# EAGLE design palm (EAGLE 9.6.2)
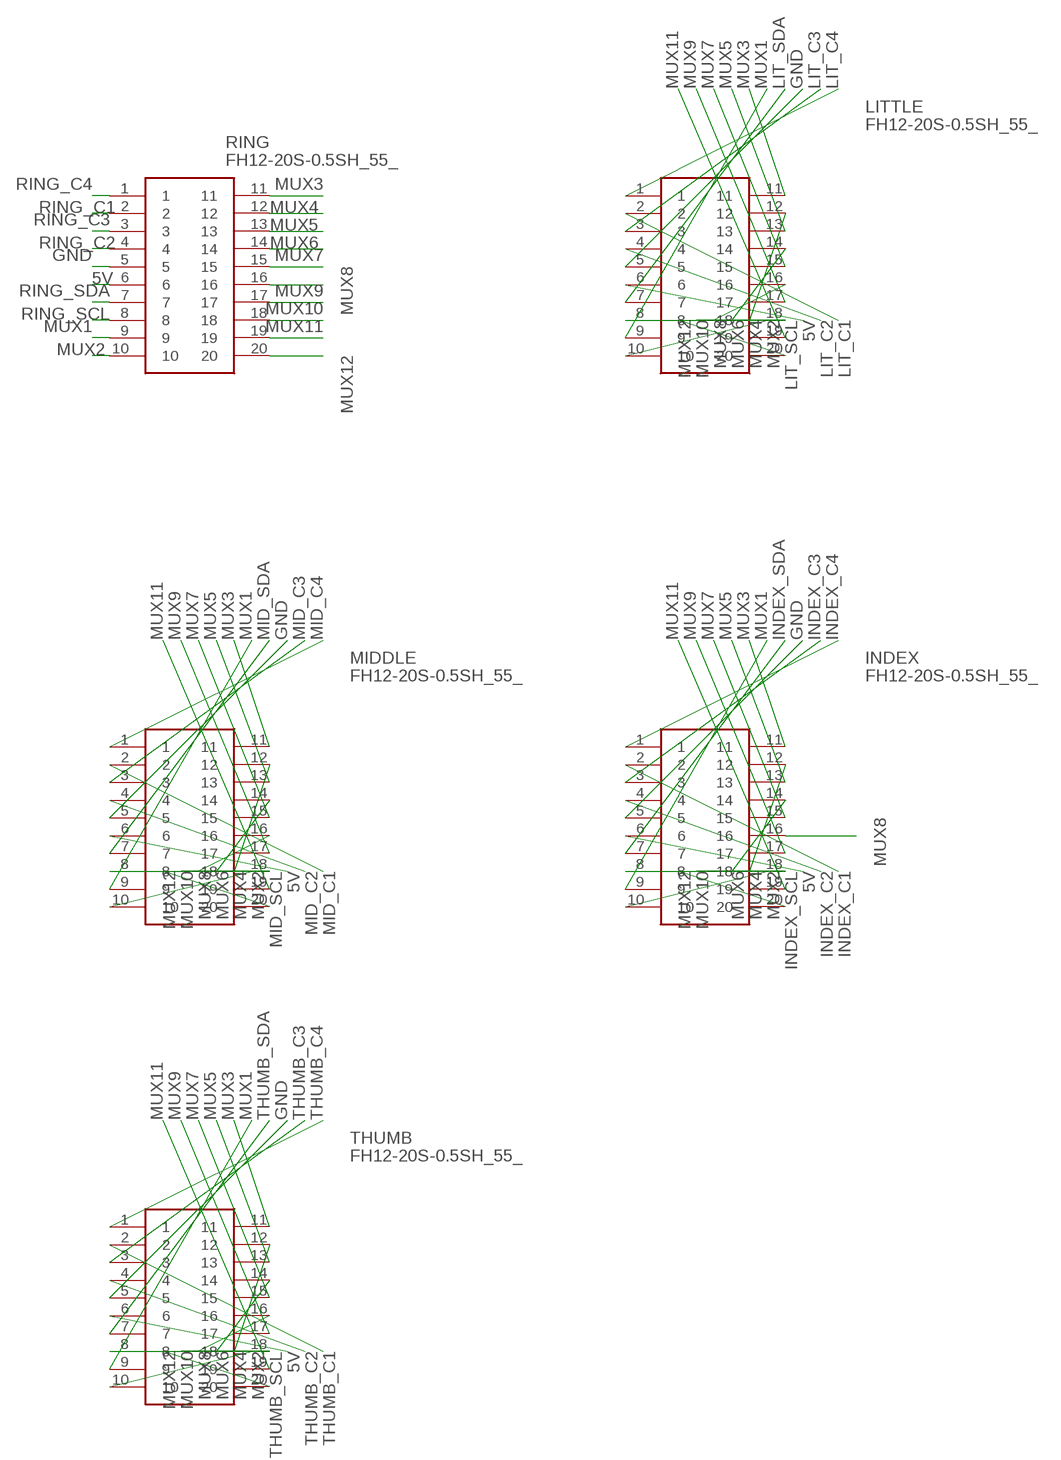
[diagram p0: schematic, sheet 1, part 1 of 2]
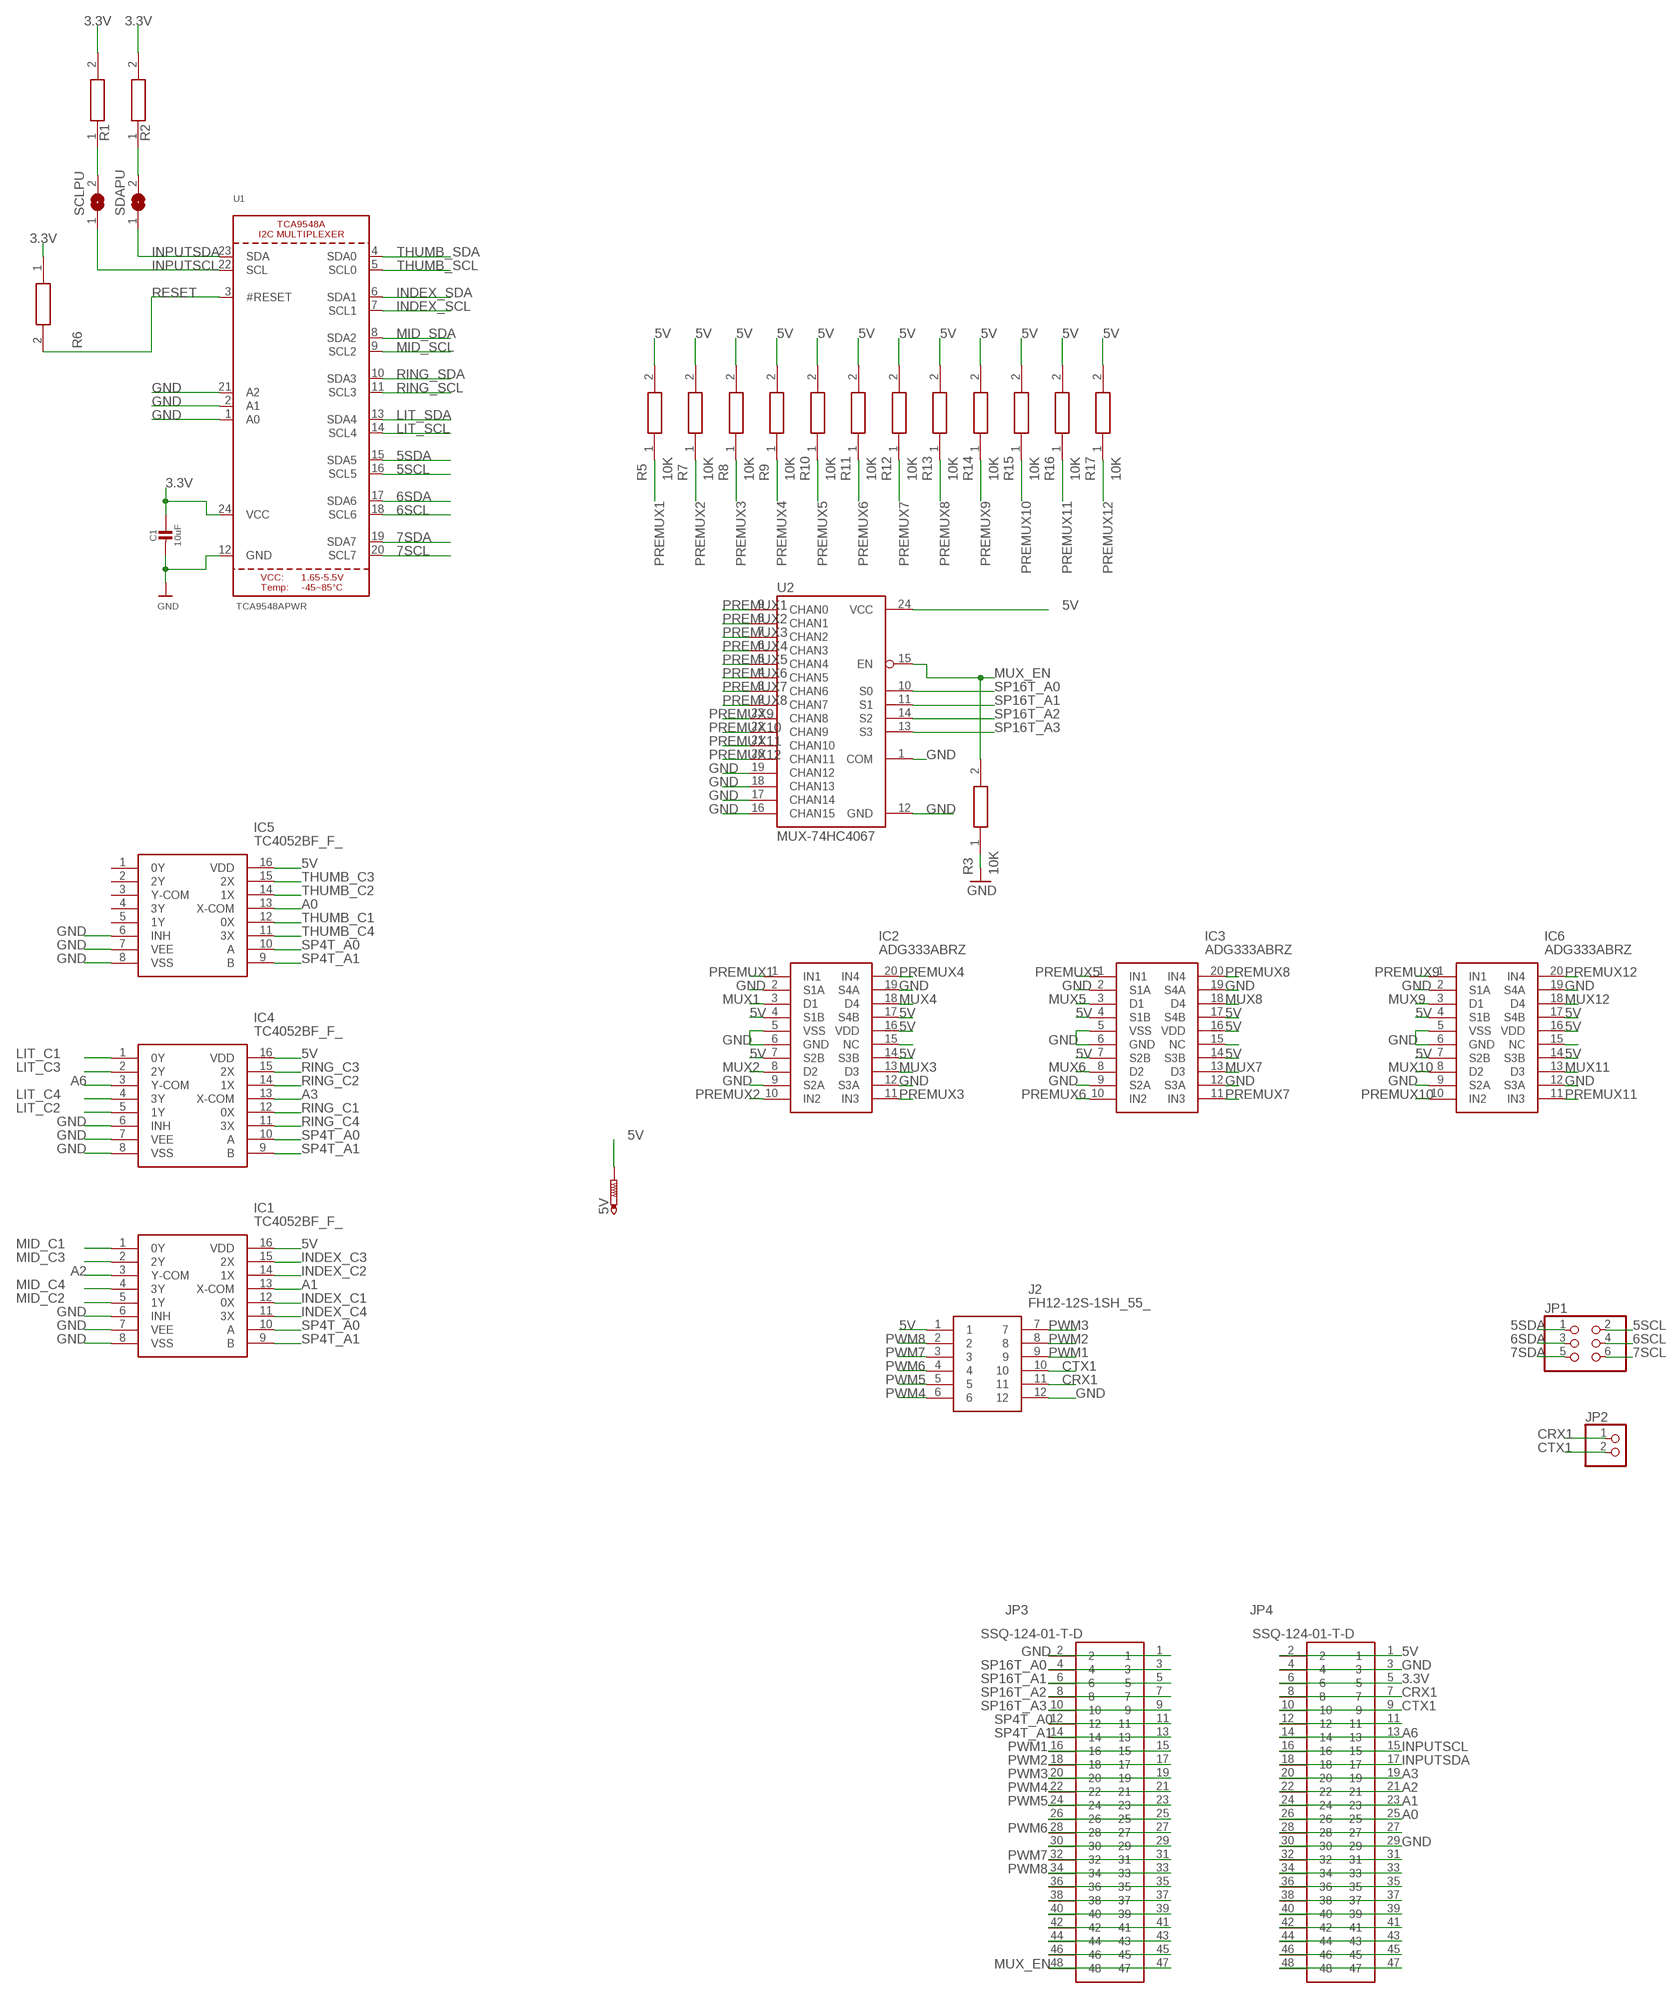
[diagram p1: schematic, sheet 1, part 2 of 2]

## Parts
5V  PTR1B1,27  [B1,27]
C1  10uF  CAP_CERAMIC0805-NOOUTLINE  [0805-NO]
IC1  TC4052BF_F_  [SOIC127P780X190-16N]
IC2  ADG333ABRZ  [SOIC127P1032X265-20N]
IC3  ADG333ABRZ  [SOIC127P1032X265-20N]
IC4  TC4052BF_F_  [SOIC127P780X190-16N]
IC5  TC4052BF_F_  [SOIC127P780X190-16N]
IC6  ADG333ABRZ  [SOIC127P1032X265-20N]
INDEX  FH12-20S-0.5SH_55_  [FH12-20S-0.5SH(55)]
J2  FH12-12S-1SH_55_  [FH12-12S-1SH(55)]
JP1  PINHD-2X3  [2X03]
JP2  PINHD-1X2  [1X02]
JP3  SSQ-124-01-T-D  [SSQ-124-XX-YYY]
JP4  SSQ-124-01-T-D  [SSQ-124-XX-YYY]
LITTLE  FH12-20S-0.5SH_55_  [FH12-20S-0.5SH(55)]
MIDDLE  FH12-20S-0.5SH_55_  [FH12-20S-0.5SH(55)]
R1  ERJ-S02J103X  [RESC1005X40N]
R2  ERJ-S02J103X  [RESC1005X40N]
R3  10K  ERJ-S02J103X  [RESC1005X40N]
R5  10K  ERJ-S02J103X  [RESC1005X40N]
R6  ERJ-S02J103X  [RESC1005X40N]
R7  10K  ERJ-S02J103X  [RESC1005X40N]
R8  10K  ERJ-S02J103X  [RESC1005X40N]
R9  10K  ERJ-S02J103X  [RESC1005X40N]
R10  10K  ERJ-S02J103X  [RESC1005X40N]
R11  10K  ERJ-S02J103X  [RESC1005X40N]
R12  10K  ERJ-S02J103X  [RESC1005X40N]
R13  10K  ERJ-S02J103X  [RESC1005X40N]
R14  10K  ERJ-S02J103X  [RESC1005X40N]
R15  10K  ERJ-S02J103X  [RESC1005X40N]
R16  10K  ERJ-S02J103X  [RESC1005X40N]
R17  10K  ERJ-S02J103X  [RESC1005X40N]
RING  FH12-20S-0.5SH_55_  [FH12-20S-0.5SH(55)]
SCLPU  SOLDERJUMPERCLOSED  [SOLDERJUMPER_CLOSEDWIRE]
SDAPU  SOLDERJUMPERCLOSED  [SOLDERJUMPER_CLOSEDWIRE]
THUMB  FH12-20S-0.5SH_55_  [FH12-20S-0.5SH(55)]
U1  TCA9548APWR  TCA9548A  [TSSOP24]
U2  MUX-74HC4067  MUX-74HC4067SMD  [SSOP24]

## Nets
3.3V: C1.1 JP4.5 JP4.6 R1.2 R2.2 R6.1 U1.24(VCC)
5SCL: JP1.2 U1.16(SCL5)
5SDA: JP1.1 U1.15(SDA5)
5V: 5V.TP IC1.16(VDD) IC2.4(S1B) IC2.7(S2B) IC2.14(S3B) IC2.16(VDD) IC2.17(S4B) IC3.4(S1B) IC3.7(S2B) IC3.14(S3B) IC3.16(VDD) IC3.17(S4B) IC4.16(VDD) IC5.16(VDD) IC6.4(S1B) IC6.7(S2B) IC6.14(S3B) IC6.16(VDD) IC6.17(S4B) INDEX.6 J2.1 JP4.1 JP4.2 LITTLE.6 MIDDLE.6 R5.2 R7.2 R8.2 R9.2 R10.2 R11.2 R12.2 R13.2 R14.2 R15.2 R16.2 R17.2 RING.6 THUMB.6 U2.24(VCC)
6SCL: JP1.4 U1.18(SCL6)
6SDA: JP1.3 U1.17(SDA6)
7SCL: JP1.6 U1.20(SCL7)
7SDA: JP1.5 U1.19(SDA7)
A0: IC5.13(X-COM) JP4.25 JP4.26
A1: IC1.13(X-COM) JP4.23 JP4.24
A2: IC1.3(Y-COM) JP4.21 JP4.22
A3: IC4.13(X-COM) JP4.19 JP4.20
A6: IC4.3(Y-COM) JP4.13 JP4.14
CRX1: J2.11 JP2.1 JP4.7 JP4.8
CTX1: J2.10 JP2.2 JP4.9 JP4.10
GND: C1.2 IC1.6(INH) IC1.7(VEE) IC1.8(VSS) IC2.2(S1A) IC2.5(VSS) IC2.6(GND) IC2.9(S2A) IC2.12(S3A) IC2.19(S4A) IC3.2(S1A) IC3.5(VSS) IC3.6(GND) IC3.9(S2A) IC3.12(S3A) IC3.19(S4A) IC4.6(INH) IC4.7(VEE) IC4.8(VSS) IC5.6(INH) IC5.7(VEE) IC5.8(VSS) IC6.2(S1A) IC6.5(VSS) IC6.6(GND) IC6.9(S2A) IC6.12(S3A) IC6.19(S4A) INDEX.5 J2.12 JP3.1 JP3.2 JP4.3 JP4.4 JP4.29 JP4.30 LITTLE.5 MIDDLE.5 R3.1 RING.5 THUMB.5 U1.1(A0) U1.2(A1) U1.12(GND) U1.21(A2) U2.1(COM) U2.12(GND) U2.16(CHAN15) U2.17(CHAN14) U2.18(CHAN13) U2.19(CHAN12)
INDEX_C1: IC1.12(0X) INDEX.2
INDEX_C2: IC1.14(1X) INDEX.4
INDEX_C3: IC1.15(2X) INDEX.3
INDEX_C4: IC1.11(3X) INDEX.1
INDEX_SCL: INDEX.8 U1.7(SCL1)
INDEX_SDA: INDEX.7 U1.6(SDA1)
INPUTSCL: JP4.15 JP4.16 SCLPU.1 U1.22(SCL)
INPUTSDA: JP4.17 JP4.18 SDAPU.1 U1.23(SDA)
LIT_C1: IC4.1(0Y) LITTLE.2
LIT_C2: IC4.5(1Y) LITTLE.4
LIT_C3: IC4.2(2Y) LITTLE.3
LIT_C4: IC4.4(3Y) LITTLE.1
LIT_SCL: LITTLE.8 U1.14(SCL4)
LIT_SDA: LITTLE.7 U1.13(SDA4)
MID_C1: IC1.1(0Y) MIDDLE.2
MID_C2: IC1.5(1Y) MIDDLE.4
MID_C3: IC1.2(2Y) MIDDLE.3
MID_C4: IC1.4(3Y) MIDDLE.1
MID_SCL: MIDDLE.8 U1.9(SCL2)
MID_SDA: MIDDLE.7 U1.8(SDA2)
MUX1: IC2.3(D1) INDEX.9 LITTLE.9 MIDDLE.9 RING.9 THUMB.9
MUX2: IC2.8(D2) INDEX.10 LITTLE.10 MIDDLE.10 RING.10 THUMB.10
MUX3: IC2.13(D3) INDEX.11 LITTLE.11 MIDDLE.11 RING.11 THUMB.11
MUX4: IC2.18(D4) INDEX.12 LITTLE.12 MIDDLE.12 RING.12 THUMB.12
MUX5: IC3.3(D1) INDEX.13 LITTLE.13 MIDDLE.13 RING.13 THUMB.13
MUX6: IC3.8(D2) INDEX.14 LITTLE.14 MIDDLE.14 RING.14 THUMB.14
MUX7: IC3.13(D3) INDEX.15 LITTLE.15 MIDDLE.15 RING.15 THUMB.15
MUX8: IC3.18(D4) INDEX.16 LITTLE.16 MIDDLE.16 RING.16 THUMB.16
MUX9: IC6.3(D1) INDEX.17 LITTLE.17 MIDDLE.17 RING.17 THUMB.17
MUX10: IC6.8(D2) INDEX.18 LITTLE.18 MIDDLE.18 RING.18 THUMB.18
MUX11: IC6.13(D3) INDEX.19 LITTLE.19 MIDDLE.19 RING.19 THUMB.19
MUX12: IC6.18(D4) INDEX.20 LITTLE.20 MIDDLE.20 RING.20 THUMB.20
MUX_EN: JP3.47 JP3.48 R3.2 U2.15(EN)
N$2: IC3.15(NC)
N$3: R1.1 SCLPU.2
N$4: R2.1 SDAPU.2
N$5: IC6.15(NC)
N$18: IC2.15(NC)
N$55: JP3.25 JP3.26
N$57: JP3.29 JP3.30
N$60: JP3.35 JP3.36
N$61: JP3.37 JP3.38
N$62: JP3.39 JP3.40
N$63: JP3.41 JP3.42
N$64: JP3.43 JP3.44
N$65: JP3.45 JP3.46
N$72: JP4.11 JP4.12
N$80: JP4.27 JP4.28
N$82: JP4.31 JP4.32
N$83: JP4.33 JP4.34
N$84: JP4.35 JP4.36
N$85: JP4.37 JP4.38
N$86: JP4.39 JP4.40
N$87: JP4.41 JP4.42
N$88: JP4.43 JP4.44
N$89: JP4.45 JP4.46
N$90: JP4.47 JP4.48
PREMUX1: IC2.1(IN1) R5.1 U2.9(CHAN0)
PREMUX2: IC2.10(IN2) R7.1 U2.8(CHAN1)
PREMUX3: IC2.11(IN3) R8.1 U2.7(CHAN2)
PREMUX4: IC2.20(IN4) R9.1 U2.6(CHAN3)
PREMUX5: IC3.1(IN1) R10.1 U2.5(CHAN4)
PREMUX6: IC3.10(IN2) R11.1 U2.4(CHAN5)
PREMUX7: IC3.11(IN3) R12.1 U2.3(CHAN6)
PREMUX8: IC3.20(IN4) R13.1 U2.2(CHAN7)
PREMUX9: IC6.1(IN1) R14.1 U2.23(CHAN8)
PREMUX10: IC6.10(IN2) R15.1 U2.22(CHAN9)
PREMUX11: IC6.11(IN3) R16.1 U2.21(CHAN10)
PREMUX12: IC6.20(IN4) R17.1 U2.20(CHAN11)
PWM1: J2.9 JP3.15 JP3.16
PWM2: J2.8 JP3.17 JP3.18
PWM3: J2.7 JP3.19 JP3.20
PWM4: J2.6 JP3.21 JP3.22
PWM5: J2.5 JP3.23 JP3.24
PWM6: J2.4 JP3.27 JP3.28
PWM7: J2.3 JP3.31 JP3.32
PWM8: J2.2 JP3.33 JP3.34
RESET: R6.2 U1.3(#RESET)
RING_C1: IC4.12(0X) RING.2
RING_C2: IC4.14(1X) RING.4
RING_C3: IC4.15(2X) RING.3
RING_C4: IC4.11(3X) RING.1
RING_SCL: RING.8 U1.11(SCL3)
RING_SDA: RING.7 U1.10(SDA3)
SP4T_A0: IC1.10(A) IC4.10(A) IC5.10(A) JP3.11 JP3.12
SP4T_A1: IC1.9(B) IC4.9(B) IC5.9(B) JP3.13 JP3.14
SP16T_A0: JP3.3 JP3.4 U2.10(S0)
SP16T_A1: JP3.5 JP3.6 U2.11(S1)
SP16T_A2: JP3.7 JP3.8 U2.14(S2)
SP16T_A3: JP3.9 JP3.10 U2.13(S3)
THUMB_C1: IC5.12(0X) THUMB.2
THUMB_C2: IC5.14(1X) THUMB.4
THUMB_C3: IC5.15(2X) THUMB.3
THUMB_C4: IC5.11(3X) THUMB.1
THUMB_SCL: THUMB.8 U1.5(SCL0)
THUMB_SDA: THUMB.7 U1.4(SDA0)
Unconnected: IC5.1(0Y) IC5.2(2Y) IC5.3(Y-COM) IC5.4(3Y) IC5.5(1Y)

## Library data of the parts
5V = testpad:PTR1: TEST PIN
C1 = microbuilder:CAP_CERAMIC: Ceramic Capacitors For new designs, use the packages preceded by an '_' character since they are more reliable: The following footprints should be used on most boards: _0402 - Standard footprint for regular board layouts _0603 - Standard footprint for regular board layouts _0805 - Standard footprint for regular board layouts _1206 - Standard footprint for regular board layouts For extremely tight-pitch boards where space is at a premium, the following 'micro-pitch' footprints can be used (smaller pads, no silkscreen outline, etc.): _0402MP - Micro-pitch footprint for very dense/compact boards _0603MP - Micro-pitch footprint for very dense/compact boards _0805MP - Micro-pitch footprint for very dense/compact boards _1206MP - Micro-pitch footprint for very dense/compact boards
IC1 IC4 IC5 = SamacSys_Parts:TC4052BF_F_: C-MOS,Standard,Series,Dual,4-Channel,Ana Toshiba TC4052BF(F), Multiplexer/Demultiplexer Dual 4:1, 12 V, 15 V, 5 V, 9 V, 16-Pin SOP Source: Datasheet <https://toshiba.semicon-storage.com/eu/product/logic/cmos-logic/detail.TC4052BF.html>; DESCRIPTION: C-MOS,Standard,Series,Dual,4-Channel,Ana Toshiba TC4052BF(F), Multiplexer/Demultiplexer Dual 4:1, 12 V, 15 V, 5 V, 9 V, 16-Pin SOP; HEIGHT: 1.9mm; MANUFACTURER_NAME: Toshiba; MANUFACTURER_PART_NUMBER: TC4052BF(F)
IC2 IC3 IC6 = SamacSys_Parts:ADG333ABRZ: Analog Devices ADG333ABRZ, Analogue SPDT Switch Quad SPDT, 20-Pin SOIC W Source: Datasheet <https://www.analog.com/media/en/technical-documentation/data-sheets/ADG333A.pdf>; DESCRIPTION: Analog Devices ADG333ABRZ, Analogue SPDT Switch Quad SPDT, 20-Pin SOIC W; HEIGHT: 2.65mm; MANUFACTURER_NAME: Analog Devices; MANUFACTURER_PART_NUMBER: ADG333ABRZ; MOUSER_PART_NUMBER: 584-ADG333ABRZ; MOUSER_PRICE-STOCK: https://www.mouser.co.uk/ProductDetail/Analog-Devices/ADG333ABRZ?qs=BpaRKvA4VqEOR9EOsgWxFw%3D%3D
INDEX LITTLE MIDDLE RING THUMB = SamacSys_Parts:FH12-20S-0.5SH_55_: FFC,0.5mm Pitch,Bottom Contact,20way Hirose FH12 Series 0.5mm Pitch 20 Way Right Angle SMT Female FPC Connector, ZIF Bottom Contact Source: Datasheet <https://componentsearchengine.com/Datasheets/2/FH12-20S-0.5SH(55).pdf>; DESCRIPTION: FFC,0.5mm Pitch,Bottom Contact,20way Hirose FH12 Series 0.5mm Pitch 20 Way Right Angle SMT Female FPC Connector, ZIF Bottom Contact; HEIGHT: mm; MANUFACTURER_NAME: Hirose; MANUFACTURER_PART_NUMBER: FH12-20S-0.5SH(55); MOUSER_PART_NUMBER: 798-FH12-20S-0.5SH55; MOUSER_PRICE-STOCK: https://www.mouser.co.uk/ProductDetail/Hirose-Connector/FH12-20S-05SH55?qs=Ux3WWAnHpjBAoMH%252Bjl1N9Q%3D%3D
J2 = SamacSys_Parts:FH12-12S-1SH_55_: Hirose FH12 Series 1mm Pitch 12 Way 1 Row Right Angle SMT Female FPC Connector, Gold Plated Contacts Source: Datasheet <https://www.hirose.com/product/en/download_file/key_name/FH12-12S-1SH(55)/category/Drawing (2D)/doc_file_id/54730/?file_category_id=6&item_id=05860741755&is_series=>; DESCRIPTION: Hirose FH12 Series 1mm Pitch 12 Way 1 Row Right Angle SMT Female FPC Connector, Gold Plated Contacts; HEIGHT: mm; MANUFACTURER_NAME: Hirose; MANUFACTURER_PART_NUMBER: FH12-12S-1SH(55); MOUSER_PART_NUMBER: 798-FH1212S1SH55; MOUSER_PRICE-STOCK: https://www.mouser.co.uk/ProductDetail/Hirose-Connector/FH12-12S-1SH55?qs=c1kC0VY36quFRZuv9h%2Fjmw%3D%3D
JP1 = pinhead:PINHD-2X3: PIN HEADER
JP2 = pinhead:PINHD-1X2: PIN HEADER
JP3 JP4 = SamacSys_Parts:SSQ-124-01-T-D: 48 Position, .100" Tiger Buy™ Socket Strip, Square Tail Source: Datasheet <http://suddendocs.samtec.com/prints/ssq-1xx-xx-xxx-x-xx-xxx-xx-x-mkt.pdf>; DESCRIPTION: 48 Position, .100&quot; Tiger Buy&trade; Socket Strip, Square Tail; HEIGHT: mm; MANUFACTURER_NAME: SAMTEC; MANUFACTURER_PART_NUMBER: SSQ-124-01-T-D; MOUSER_PART_NUMBER: 200-SSQ12401TD; MOUSER_PRICE-STOCK: https://www.mouser.co.uk/ProductDetail/Samtec/SSQ-124-01-T-D?qs=rU5fayqh%252BE3y%2FCQLrlIRAQ%3D%3D
R1-R3 R5-R17 = SamacSys_Parts:ERJ-S02J103X: Thick Film Resistors - SMD 0402 10Kohms 5% Anti-Sulfur Source: Datasheet <https://industrial.panasonic.com/cdbs/www-data/pdf/RDP0000/AOA0000C334.pdf>; DESCRIPTION: Thick Film Resistors - SMD 0402 10Kohms 5% Anti-Sulfur; HEIGHT: 0.4mm; MANUFACTURER_NAME: Panasonic; MANUFACTURER_PART_NUMBER: ERJ-S02J103X
SCLPU SDAPU = microbuilder:SOLDERJUMPER: SMD Solder JUMPER Solder the two pads together to create a connection, or remove the solder to break it. REFLOW - Use this footprint for solder paste and reflow ovens. WAVE - Use this footprint for hand-soldering (larger pads). CLOSED - Has a trace between the two pads to ensure it is closed by default. The trace needs to be cut to disable the jumper, and can be closed again by creating a solder bridge between the two pads.
U1 = microbuilder:TCA9548A: TCA9548A I2C Multiplexer
U2 = SparkFun:MUX-74HC4067

## Board
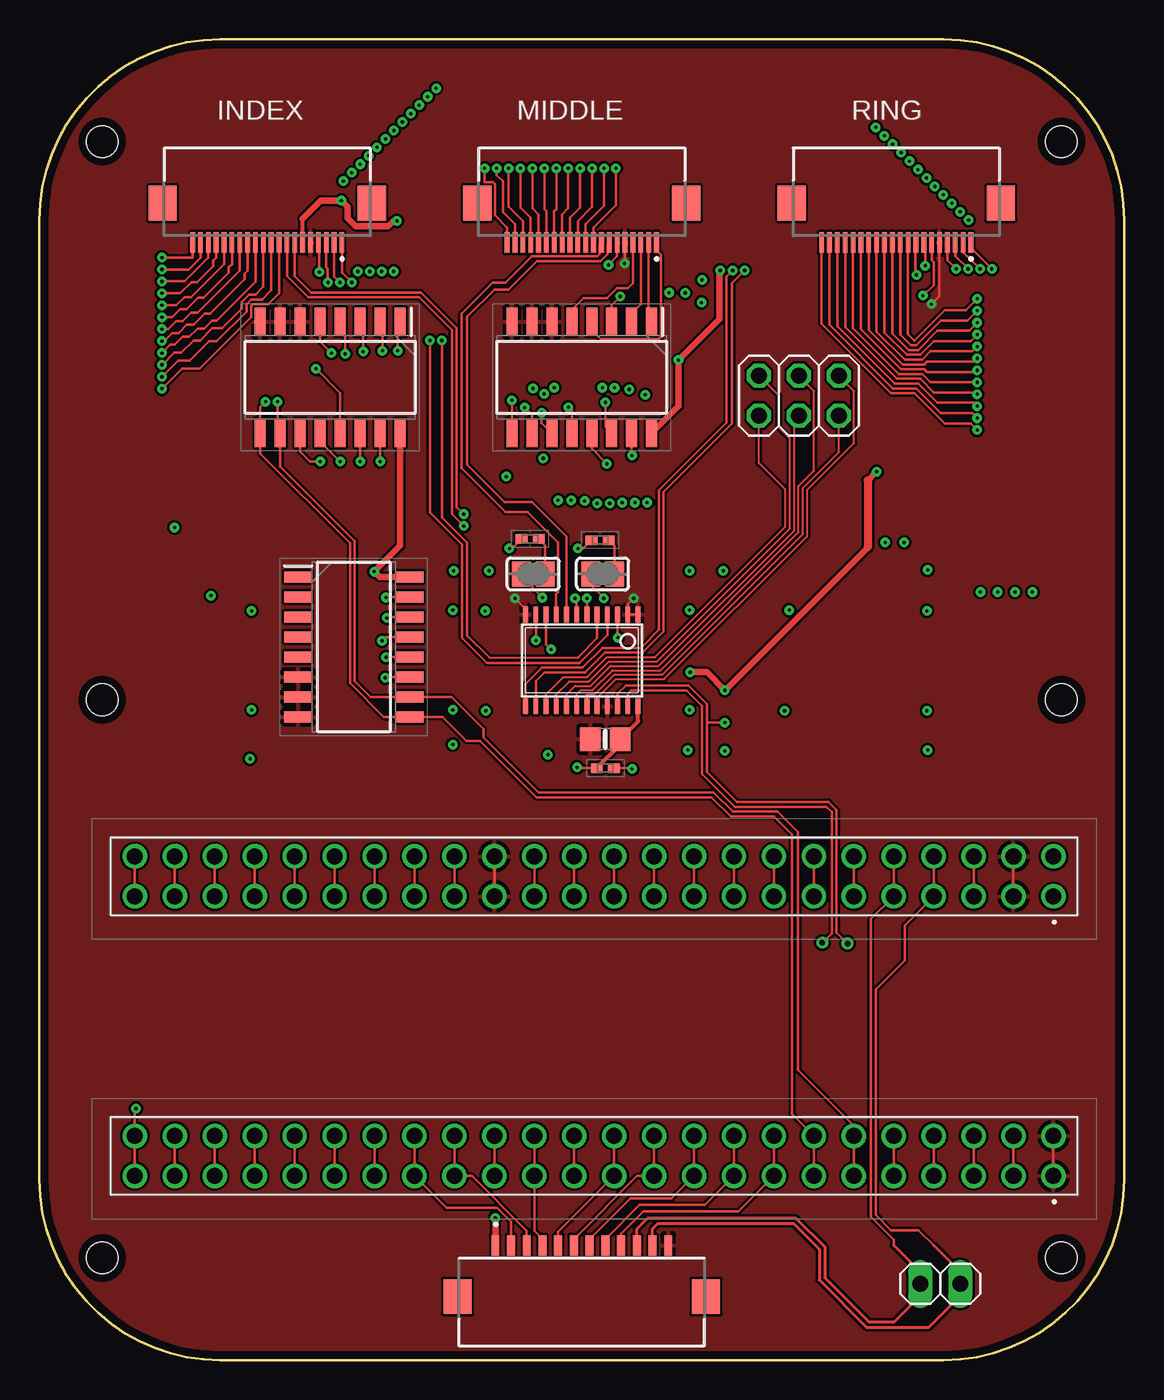
[diagram p2: board, top side]
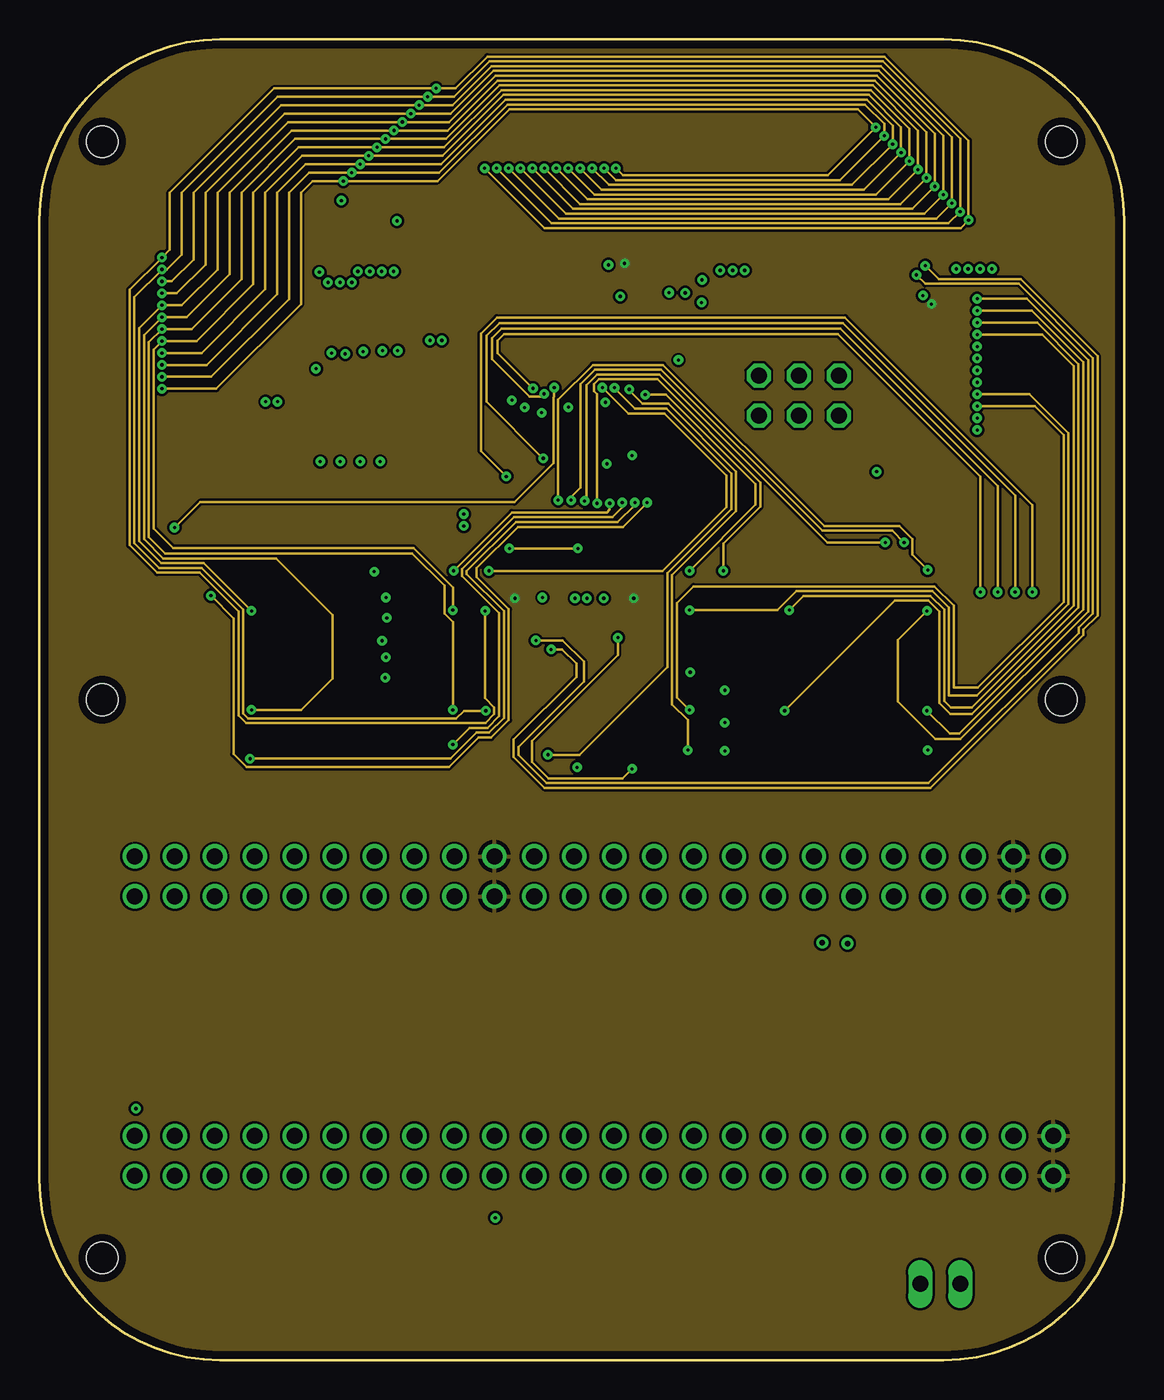
[diagram p3: board, inner layer Route2]
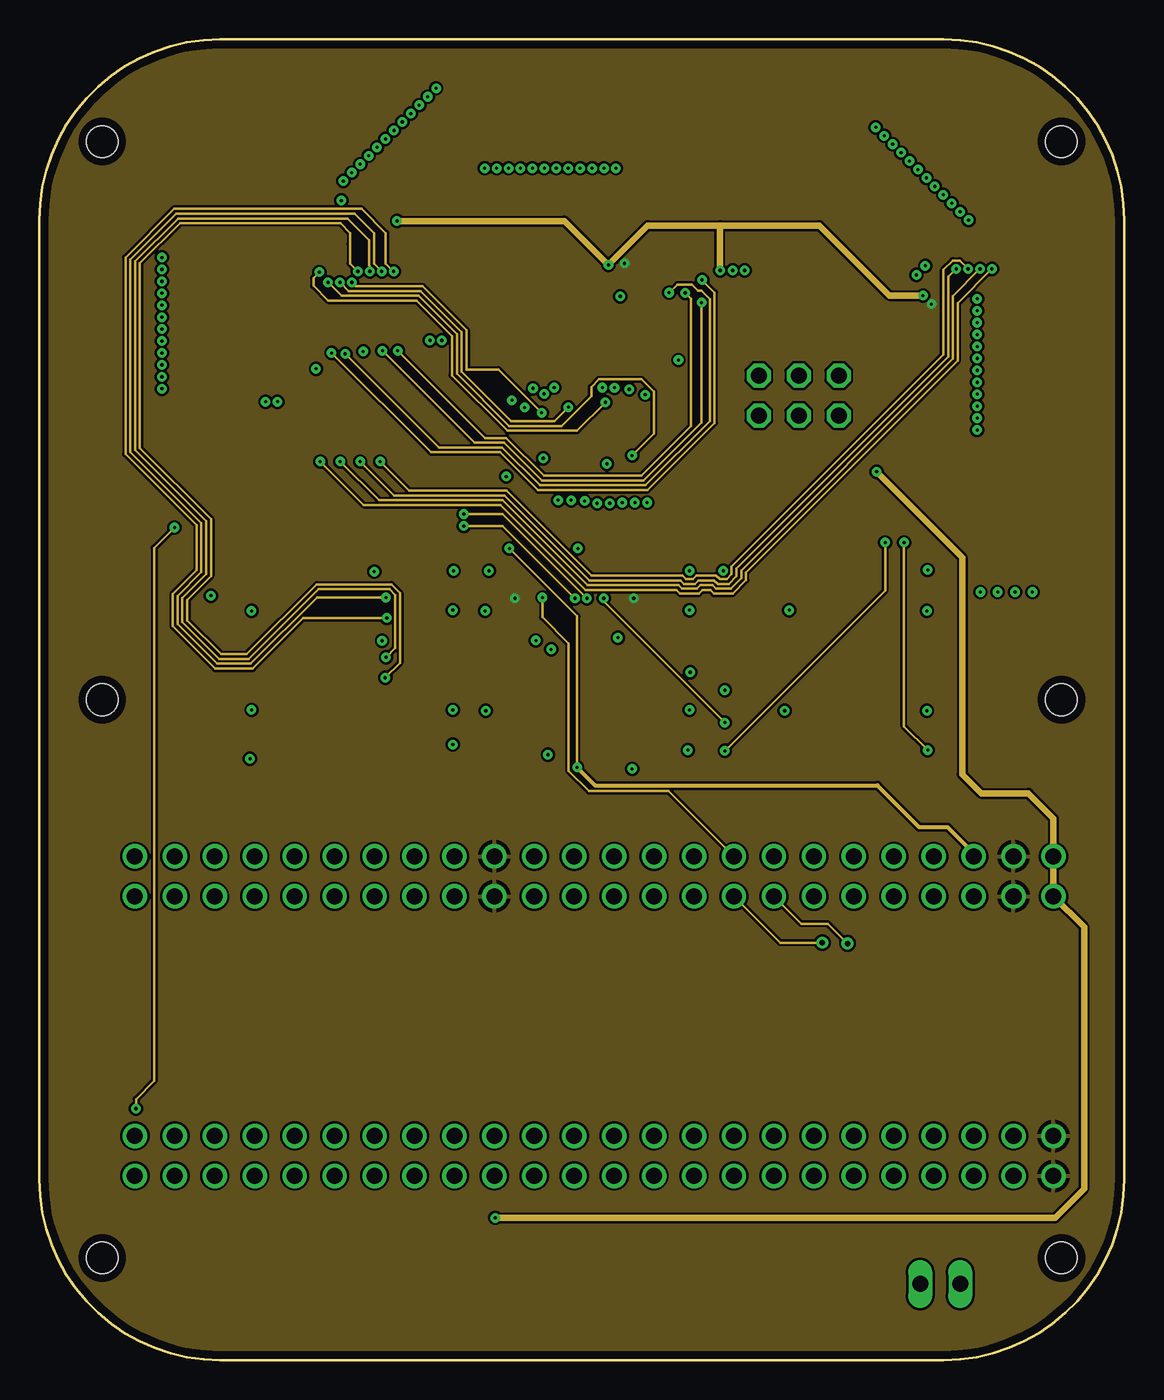
[diagram p4: board, inner layer Route15]
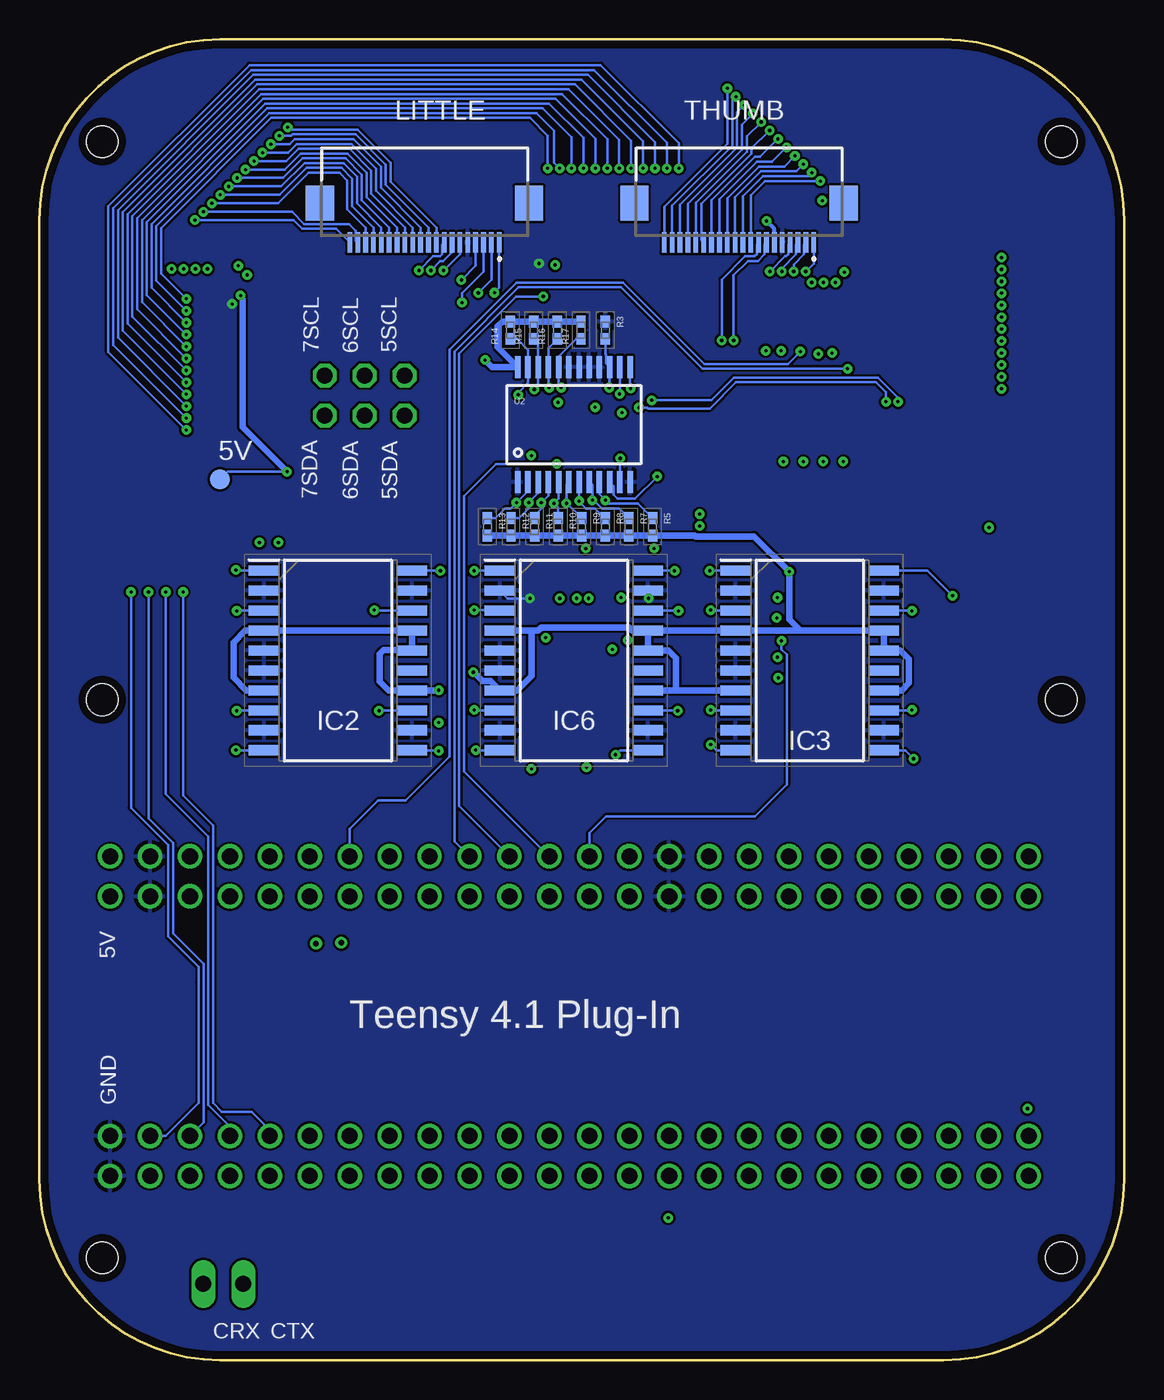
[diagram p5: board, bottom side, seen from below]

Size 69 x 84 mm. Coordinates in mm from the lower left corner, seen from the top.
Outline: 0,72.5 0,11.5 arc90 11.5,0 57.5,0 arc90 69,11.5 69,72.5 arc90 57.5,84 11.5,84 arc90 0,72.5
Copper layers (1+2*15+16): Top 0.035mm / dielectric 0.2mm / Route2 0.0175mm / dielectric 1.065mm / Route15 0.0175mm / dielectric 0.2mm / Bottom 0.035mm
Design rules "default *": minimum track width 4mil, minimum drill 0.2mm, track to track 6mil, track to pad 6mil, pad to pad 6mil, via to via 6mil, smd to smd 6mil, copper to edge 20mil, drill to drill 6mil, minimum pad ring 10mil, minimum via ring 8mil, stop-mask expansion 4mil, vias tented up to drill 0mil, thermal gap 10mil
Holes 2 mm at 65,6.5 4,6.5 4,77.5 65,77.5 4,42 65,42

### Footprints (pad centres in the part's own frame; a part is rotated, then mirrored left to right if it is on the bottom)
B1,27 = smd 1.27 x 1.27: TP 0,0
0805-NO = smd 1.3 x 1.5: 1 -0.95,0; 2 0.95,0
SOIC127P780X190-16N = smd 1.775 x 0.7: 1 -3.538,4.445; 2 -3.538,3.175; 3 -3.538,1.905; 4 -3.538,0.635; 5 -3.538,-0.635; 6 -3.538,-1.905; 7 -3.538,-3.175; 8 -3.538,-4.445; 9 3.538,-4.445; 10 3.538,-3.175; 11 3.538,-1.905; 12 3.538,-0.635; 13 3.538,0.635; 14 3.538,1.905; 15 3.538,3.175; 16 3.538,4.445
SOIC127P1032X265-20N = smd 1.925 x 0.65: 1 -4.712,5.715; 2 -4.712,4.445; 3 -4.712,3.175; 4 -4.712,1.905; 5 -4.712,0.635; 6 -4.712,-0.635; 7 -4.712,-1.905; 8 -4.712,-3.175; 9 -4.712,-4.445; 10 -4.712,-5.715; 11 4.712,-5.715; 12 4.712,-4.445; 13 4.712,-3.175; 14 4.712,-1.905; 15 4.712,-0.635; 16 4.712,0.635; 17 4.712,1.905; 18 4.712,3.175; 19 4.712,4.445; 20 4.712,5.715
FH12-20S-0.5SH(55) = smd 0.3 x 1.3: 1 4.75,-0.422; 2 4.25,-0.422; 3 3.75,-0.422; 4 3.25,-0.422; 5 2.75,-0.422; 6 2.25,-0.422; 7 1.75,-0.422; 8 1.25,-0.422; 9 0.75,-0.422; 10 0.25,-0.422; 11 -0.25,-0.422; 12 -0.75,-0.422; 13 -1.25,-0.422; 14 -1.75,-0.422; 15 -2.25,-0.422; 16 -2.75,-0.422; 17 -3.25,-0.422; 18 -3.75,-0.422; 19 -4.25,-0.422; 20 -4.75,-0.422 | smd 1.8 x 2.2: 21 -6.65,2.078; 22 6.65,2.078
FH12-12S-1SH(55) = smd 0.5 x 1.3: 1 -5.5,0.8; 2 -4.5,0.8; 3 -3.5,0.8; 4 -2.5,0.8; 5 -1.5,0.8; 6 -0.5,0.8; 7 0.5,0.8; 8 1.5,0.8; 9 2.5,0.8; 10 3.5,0.8; 11 4.5,0.8; 12 5.5,0.8 | smd 1.8 x 2.2: 13 -7.9,-2.45; 14 7.9,-2.45
2X03 = drill 1.016 octagon: 1 -2.54,-1.27; 2 -2.54,1.27; 3 0,-1.27; 4 0,1.27; 5 2.54,-1.27; 6 2.54,1.27
1X02 = drill 1.016 long: 1 -1.27,0; 2 1.27,0
SSQ-124-XX-YYY = drill 1.02 pad 1.55: 1 0,0; 2 0,2.54; 3 -2.54,0; 4 -2.54,2.54; 5 -5.08,0; 6 -5.08,2.54; 7 -7.62,0; 8 -7.62,2.54; 9 -10.16,0; 10 -10.16,2.54; 11 -12.7,0; 12 -12.7,2.54; 13 -15.24,0; 14 -15.24,2.54; 15 -17.78,0; 16 -17.78,2.54; 17 -20.32,0; 18 -20.32,2.54; 19 -22.86,0; 20 -22.86,2.54; 21 -25.4,0; 22 -25.4,2.54; 23 -27.94,0; 24 -27.94,2.54; 25 -30.48,0; 26 -30.48,2.54; 27 -33.02,0; 28 -33.02,2.54; 29 -35.56,0; 30 -35.56,2.54; 31 -38.1,0; 32 -38.1,2.54; 33 -40.64,0; 34 -40.64,2.54; 35 -43.18,0; 36 -43.18,2.54; 37 -45.72,0; 38 -45.72,2.54; 39 -48.26,0; 40 -48.26,2.54; 41 -50.8,0; 42 -50.8,2.54; 43 -53.34,0; 44 -53.34,2.54; 45 -55.88,0; 46 -55.88,2.54; 47 -58.42,0; 48 -58.42,2.54
RESC1005X40N = smd 0.75 x 0.6: 1 -0.55,0; 2 0.55,0
SOLDERJUMPER_CLOSEDWIRE = smd 1.168 x 1.6: 1 -0.762,0; 2 0.762,0 | smd 0.635 x 0.203: WIRE 0,0
TSSOP24 = smd 0.305 x 0.991: 1 -3.575,-2.918; 2 -2.925,-2.918; 3 -2.275,-2.918; 4 -1.625,-2.918; 5 -0.975,-2.918; 6 -0.325,-2.918; 7 0.325,-2.918; 8 0.975,-2.918; 9 1.625,-2.918; 10 2.275,-2.918; 11 2.925,-2.918; 12 3.575,-2.918; 13 3.575,2.918; 14 2.925,2.918; 15 2.275,2.918; 16 1.625,2.918; 17 0.975,2.918; 18 0.325,2.918; 19 -0.325,2.918; 20 -0.975,2.918; 21 -1.625,2.918; 22 -2.275,2.918; 23 -2.925,2.918; 24 -3.575,2.918
SSOP24 = smd 0.348 x 1.397: 1 -3.575,-3.656; 2 -2.925,-3.656; 3 -2.275,-3.656; 4 -1.625,-3.656; 5 -0.975,-3.656; 6 -0.325,-3.656; 7 0.325,-3.656; 8 0.975,-3.656; 9 1.625,-3.656; 10 2.275,-3.656; 11 2.925,-3.656; 12 3.575,-3.656; 13 3.575,3.656; 14 2.925,3.656; 15 2.275,3.656; 16 1.625,3.656; 17 0.975,3.656; 18 0.325,3.656; 19 -0.325,3.656; 20 -0.975,3.656; 21 -1.625,3.656; 22 -2.275,3.656; 23 -2.925,3.656; 24 -3.575,3.656

### Placement (x,y rotation side)
5V  57.5,56.01 0 bottom
C1  36,39.5 180 top
IC1  34.5,62.5 270 top
IC2  50,44.5 0 bottom
IC3  20,44.5 0 bottom
IC4  18.5,62.5 270 top
IC5  20,45.36 0 top
IC6  35,44.5 0 bottom
INDEX  14.5,71.5 0 top
J2  34.5,6.5 0 top
JP1  48.3,61.35 0 top
JP2  57.3,4.85 180 top
JP3  64.5,11.72 0 top
JP4  64.5,29.5 0 top
LITTLE  44.5,71.5 0 bottom
MIDDLE  34.5,71.5 0 top
R1  35.67,52.15 180 top
R2  31.21,52.23 180 top
R3  33,65.5 270 bottom
R5  30,53 270 bottom
R6  36,37.65 0 top
R7  31.5,53 270 bottom
R8  33,53 270 bottom
R9  34.5,53 270 bottom
R10  36,53 270 bottom
R11  37.5,53 270 bottom
R12  39,53 270 bottom
R13  40.5,53 270 bottom
R14  39.05,65.5 90 bottom
R15  37.55,65.5 90 bottom
R16  36.05,65.5 90 bottom
R17  34.55,65.5 90 bottom
RING  54.5,71.5 0 top
SCLPU  35.83,50 0 top
SDAPU  31.41,50 0 top
THUMB  24.5,71.5 0 bottom
U1  34.5,44.5 180 top
U2  35,59.5 0 bottom

### Tracks (layer width: path | path; a pad name or v marks a point on that pad's centre or on a via)
3.3V  (via drill 0.2)
  Top 0.152: JP4.6 JP4.5 | R1.2 34.59,51.62 v34.25,51.62 | R2.2 30.05,51.62 v29.9,51.62 | R6.1 34.25,37.65 v34.2,37.7
  Top 0.254: R6.1 36.95,39.15 C1.1 38.08,40.62 U1.24
  Route2 0.152: v29.9,51.62 v34.25,51.62
  Route15 0.152: v34.2,37.7 34.2,47.32 v29.9,51.62
  Route15 0.254: v34.2,37.7 35.35,36.55 53.3,36.55 55.95,33.9 57.75,33.9 59.42,32.23 JP4.6
5SCL
  Top 0.127: U1.16 32.88,42.33 33.71,43.16 34.95,43.16 36.22,44.43 39.27,44.43 47.73,52.88 47.73,58.62 47.03,59.32 47.03,61.35 JP1.2
5SDA
  Top 0.127: U1.15 32.23,42.33 33.34,43.44 34.84,43.44 36.1,44.71 39.16,44.71 47.45,53 47.45,55.35 45.76,57.04 JP1.1
5V  (via drill 0.2)
  Top 0.152: RING.6 56.75,69.95 56.88,69.82 56.88,68.38 v56.2,67.7 | MIDDLE.6 36.75,70.2 v36.2,69.65
  Top 0.254: INDEX.6 16.75,72.6
  Top 0.406: IC5.16 21.64,49.8 v21.3,50.15 22.95,51.8 IC4.16 | 16.75,72.6 17.9,73.75 v19.21,73.75 19.6,73.35 19.6,72.62 20.1,72.12 22.2,72.12 22.52,72.45 v22.75,72.45 | v41.4,43.75 42.45,43.75 v43.6,42.6 52.69,51.69 | IC1.16 40.65,60.67 v40.65,63.6 43.27,66.22 43.27,69.08 43.3,69.11 v43.3,69.3 | v53.25,56.5 52.69,55.94 | J2.1 v29,9.05
  Top 0.508: 52.69,55.94 52.69,51.69
  Route15 0.406: v22.75,72.45 33.4,72.45 v36.2,69.65 36.56,70.01 36.56,70.02 38.69,72.15 43.3,72.15 | v56.2,67.7 54.05,67.7 49.6,72.15 43.3,72.15 | v43.3,69.3 43.3,72.15 | v53.25,56.5 58.7,51.05 58.7,37.25 59.9,36.05 62.9,36.05 64.5,34.45 JP4.2 JP4.1 66.45,27.55 66.45,10.9 64.6,9.05 v29,9.05
  Bottom 0.152: 39,66.05 R14.2 | LITTLE.6 42.25,70.35 v43.3,69.3 | 5V.TP 57.01,56.5 v53.25,56.5
  Bottom 0.254: THUMB.6 22.25,71.95 v22.75,72.45
  Bottom 0.406: IC3.14 14.16,42.59 13.7,43.05 13.7,44.6 14.23,45.13 IC3.16 IC3.17 20.6,46.41 | IC3.7 28.5,42.59 | 28.5,42.59 IC6.14 | IC6.17 IC3.4 22.08,46.41 22.07,46.41 21.53,46.41 21.52,46.41 20.6,46.41 | IC6.17 IC6.16 28.98,45.13 28.5,44.65 28.5,42.59 | IC6.17 31.29,46.41 31.49,46.61 37.07,46.61 37.28,46.41 37.7,46.41 | 37.7,46.41 IC6.4 | 37.7,46.41 37.7,43.5 38.61,42.59 IC6.7 40.3,43.18 40.82,43.18 41.39,43.75 v41.4,43.75 | IC2.7 55.84,42.59 56.65,43.4 56.65,45.65 55.89,46.41 IC2.4 IC2.17 IC2.16 45.3,45.15 47.1,45.15 47.35,44.9 47.35,43.15 46.8,42.59 IC2.14 v43.61,42.59 v43.6,42.6 | 20.6,46.41 21.3,47.1 v21.3,50.15 23.54,52.39 27.27,52.39 27.33,52.45 R5.2 R7.2 R8.2 R9.2 R10.2 R11.2 R12.2 R13.2 | R17.2 R16.2 R15.2 39,66.05 39.55,66.05 39.85,65.75 39.85,64.43 U2.24 40.21,63.16 v40.65,63.6 | v56.2,67.7 56.2,67.56 56.08,67.44 56.08,59.33 v53.25,56.5
6SCL
  Top 0.127: U1.18 34.17,42.33 34.45,42.6 35.19,42.6 36.45,43.87 39.51,43.87 48.29,52.65 48.29,55.58 49.28,56.57 49.28,61.64 JP1.4
6SDA
  Top 0.127: U1.17 33.52,42.33 34.08,42.88 35.07,42.88 36.33,44.15 39.39,44.15 48.01,52.77 48.01,59.79 JP1.3
7SCL
  Top 0.127: U1.20 35.48,42.1 36.68,43.31 39.74,43.31 48.85,52.42 48.85,55.35 51.82,58.32 51.82,61.64 JP1.6
7SDA
  Top 0.127: U1.19 34.83,42.33 35.3,42.33 36.56,43.59 39.62,43.59 48.57,52.54 48.57,55.47 50.84,57.74 JP1.5
A0  (via drill 0.2)
  Top 0.152: IC5.13 22.05,45.99 v21.8,45.75 | JP4.26 JP4.25
  Bottom 0.152: v21.8,45.75 21.8,45.2 21.47,44.87 21.47,36.61 23.49,34.59 32.95,34.59 34.02,33.52 JP4.26
A1  (via drill 0.2)
  Top 0.152: IC1.13 35.13,57.97 v36.1,57 | JP4.24 JP4.23
  Bottom 0.152: v36.1,57 39.94,57 41.99,54.95 41.99,37.44 36.59,32.04 JP4.24
A2  (via drill 0.2)
  Top 0.152: IC1.3 36.41,67.11 v36.95,67.65 | JP4.22 JP4.21
  Bottom 0.152: v36.95,67.65 38.67,67.65 42.3,64.02 42.3,35.23 JP4.22
A3  (via drill 0.2)
  Top 0.152: IC4.13 19.13,61.52 v17.6,63.05 | JP4.20 JP4.19
  Bottom 0.152: v17.6,63.05 v17.61,63.05 26.83,63.05 32.02,68.23 38.52,68.23 42.6,64.15 42.6,38.35 42.6,38.27 42.6,33 JP4.20
A6  (via drill 0.2)
  Top 0.152: IC4.3 20.6,65.84 v20.6,64.15 | JP4.14 JP4.13
  Bottom 0.152: v20.6,64.15 21.4,63.35 26.7,63.35 31.89,68.54 38.64,68.54 42.91,64.28 42.91,38.39 45.7,35.6 47.45,35.6 49.26,33.79 JP4.14
CRX1
  Top 0.152: JP4.8 JP4.7 55.04,27.66 55.04,25.43 53.2,23.59 53.2,9.23 54.17,8.27 55.92,8.27 56.88,7.3
  Top 0.2: 56.88,7.3 58.57,5.61 JP2.1 58.57,4.09 56.58,2.1 52.61,2.1 49.6,5.1 49.6,7.05 47.95,8.7 39.35,8.7 39,8.35 J2.11
CTX1
  Top 0.152: JP4.10 JP4.9 52.89,28.05 52.89,9.1 54.34,7.66 54.34,7.3
  Top 0.2: 54.34,7.3 56.03,5.61 JP2.2 56.03,4.09 54.39,2.45 52.75,2.45 49.95,5.25 49.95,7.2 48.1,9.05 38.7,9.05 38,8.35 J2.10
GND  (via drill 0.2)
  Top 0.152: v56.74,67.16 57.25,67.68 RING.5 | JP3.1 JP3.2 | JP4.30 JP4.29 | MIDDLE.5 37.25,69.78 v37.22,69.75 | JP4.4 JP4.3 | U1.1 U1.2 37.42,48.08 v37.8,48.45 | U1.12 30.93,47.78 v30.25,48.46
  Bottom 0.152: v37.8,48.45 39.22,48.45 IC6.2 | v30.25,48.46 30.25,48.91 IC6.19
  pour Top: -1.35,84.9 -1.35,5.8 5.3,-0.85 64.55,-0.85 70.15,4.75 70.15,80.45 65.7,84.9
  pour Route2: -1.35,80.7 -1.35,4.7 4.15,-0.8 63.65,-0.8 69.85,5.4 69.85,80.8 65.45,85.2 3.15,85.2
  pour Route15: -1.3,81 -1.3,3.85 3.65,-1.1 63.75,-1.1 69.85,5 69.85,80.55 64.95,85.45 3.15,85.45
  pour Bottom: -0.85,81.25 -0.85,3.65 3.7,-0.9 64.95,-0.9 69.85,4 69.85,80.1 64.55,85.4 3.3,85.4
INDEX_C1  (via drill 0.2)
  Top 0.152: IC1.12 33.87,60.38 v33.65,60.6 | INDEX.2 18.75,68.92 v19.12,68.54
  Route15 0.152: v19.12,68.54 19.67,68 24.25,68 26.86,65.39 26.86,62.87 30.02,59.72 32.77,59.72 v33.65,60.6
INDEX_C2  (via drill 0.2)
  Top 0.152: IC1.14 36.01,59.36 v36.01,60.91 | INDEX.4 17.81,71.02 v17.81,69.2
  Route15 0.152: v17.81,69.2 17.43,68.82 17.43,68.32 18.37,67.39 24,67.39 26.25,65.14 26.25,62.62 29.76,59.11 34.21,59.11 v36.01,60.91
INDEX_C3  (via drill 0.2)
  Top 0.152: INDEX.3 18.25,69.51 18.34,69.42 18.34,68.57 v18.36,68.54 | IC1.15 37.67,57.56 v37.7,57.53
  Route15 0.152: v18.36,68.54 19.22,67.69 24.13,67.69 26.55,65.26 26.55,62.75 29.89,59.41 33.22,59.41 35.1,61.3 35.1,61.89 35.59,62.38 38.31,62.38 39.08,61.61 39.08,58.91 v37.7,57.53
INDEX_C4  (via drill 0.2)
  Top 0.152: IC1.11 31.95,59.61 v31.95,60.25 | INDEX.1 19.25,69.17 v19.88,68.54
  Route15 0.152: v19.88,68.54 20.12,68.3 24.38,68.3 27.16,65.51 27.16,63 29.2,63 v31.95,60.25
INDEX_SCL  (via drill 0.2)
  Top 0.152: U1.7 34.17,48.22 34.07,48.32 v34.07,48.45 | v27,53.05 26.24,53.81 26.24,65.5 24.14,67.6 17.1,67.6 15.75,68.95 INDEX.8
  Route15 0.152: v34.07,48.45 29.47,53.05 v27,53.05
INDEX_SDA  (via drill 0.2)
  Top 0.152: U1.6 34.83,48.22 v34.83,48.45 | v27,53.81 26.55,54.26 26.55,65.63 24.27,67.91 17.3,67.91 16.25,68.95 INDEX.7
  Route15 0.152: v27,53.81 29.47,53.81 v34.83,48.45
INPUTSCL  (via drill 0.2, 0.35)
  Top 0.152: U1.22 36.77,42.38 37.3,42.91 41.28,42.91 42.45,41.73 42.45,40.55 | 42.45,40.55 42.45,37.4 44.36,35.5 50.19,35.5 50.7,34.99 50.7,27.2 v51.4,26.5 | JP4.16 JP4.15 | SCLPU.1 35.07,49.29 v35.9,48.45 | 42.45,40.55 v43.6,40.55
  Route15 0.152: v43.6,40.55 35.9,48.25 v35.9,48.45 | v51.4,26.5 50.15,27.75 48.47,27.75 JP4.15
INPUTSDA  (via drill 0.2, 0.35)
  Top 0.152: U1.23 37.42,42.38 37.64,42.6 41.15,42.6 42.15,41.6 42.15,37.27 44.23,35.2 50.06,35.2 50.4,34.86 50.4,27.15 v49.8,26.55 | JP4.18 JP4.17 | SDAPU.1 31.36,49.29 31.36,49.11 31.49,48.97 31.53,48.97 v32,48.5
  Route15 0.152: v32,48.5 32,47.25 33.67,45.58 33.67,37.48 34.95,36.19 38.8,36.19 38.89,36.19 40.03,36.19 JP4.18 | v49.8,26.55 47.13,26.55 JP4.17
LIT_C1  (via drill 0.2)
  Top 0.152: IC4.1 22.8,65.89 v22.8,64.2
  Route15 0.152: v22.8,64.2 28.34,58.65 29.69,58.65 32.1,56.25 38.3,56.25 41.45,59.4 41.45,67.5 v41.08,67.88
  Bottom 0.152: v41.08,67.88 40.25,68.7 LITTLE.2
LIT_C2  (via drill 0.2)
  Top 0.152: IC4.5 17.86,64.77 v18.59,64.05
  Route15 0.152: v18.59,64.05 24.9,57.74 29.31,57.74 31.72,55.33 38.67,55.33 42.95,59.61 42.95,67.9 v42.15,68.7
  Bottom 0.152: v42.15,68.7 41.25,69.6 LITTLE.4
LIT_C3  (via drill 0.2)
  Top 0.152: IC4.2 21.82,65.89 v21.82,64.2
  Route15 0.152: v21.82,64.2 27.68,58.34 29.57,58.34 31.97,55.94 38.42,55.94 42.11,59.63 v42.11,67.26
  Bottom 0.152: v42.11,67.26 42.11,67.86 40.75,69.23 LITTLE.3
LIT_C4  (via drill 0.2)
  Top 0.152: v19.45,64 19.45,65.13 19.13,65.45 IC4.4
  Route15 0.152: v19.45,64 25.41,58.04 29.44,58.04 31.84,55.64 38.55,55.64 42.64,59.73 42.64,67.48 42.13,68 41.9,68 41.49,68.41 40.57,68.41 v40.05,67.89
  Bottom 0.152: v40.05,67.89 39.75,68.2 LITTLE.1
LIT_SCL  (via drill 0.2)
  Top 0.152: U1.14 31.57,43.18 32.13,43.74 34.72,43.74 35.98,45 38.38,45 39.7,46.33 39.7,55.2 44.06,59.56 44.06,68.5 v44.86,69.3
  Bottom 0.152: LITTLE.8 43.37,70.96 43.37,70.33 43.51,70.2 43.96,70.2 v44.86,69.3
LIT_SDA  (via drill 0.2)
  Top 0.152: U1.13 30.93,43 31.96,44.04 34.54,44.04 35.8,45.3 38.25,45.3 39.4,46.45 39.4,55.33 43.7,59.63 43.7,68.9 v44.1,69.3
  Bottom 0.152: v44.1,69.3 43.51,69.89 43.31,69.89 42.75,70.45 LITTLE.7
MID_C1
  Top 0.152: MIDDLE.2 38.75,66.23 IC1.1
MID_C2
  Top 0.152: IC1.5 33.87,66.81 34.6,67.55 36.1,67.55 36.73,68.18 37.43,68.18 37.75,68.5 MIDDLE.4
MID_C3
  Top 0.152: MIDDLE.3 38.25,67.15 37.67,66.58 IC1.2
MID_C4
  Top 0.152: MIDDLE.1 39.25,70.58 39.52,70.3 39.52,65.06 39.39,64.92 35.71,64.92 35.13,65.5 IC1.4
MID_SCL
  Top 0.152: U1.9 32.88,48.73 32.98,48.84 32.98,52 31.04,53.95 29.64,53.95 26.85,56.74 26.85,66.55 28.81,68.51 29.66,68.51 31.34,70.2 35.49,70.2 35.63,70.33 35.63,70.96 MIDDLE.8
MID_SDA
  Top 0.152: U1.8 33.52,52.38 31.34,54.57 29.58,54.57 27.2,56.95 27.2,66.35 28.94,68.09 29.84,68.09 31.64,69.89 35.69,69.89 36.13,70.33 36.13,70.96 MIDDLE.7
MUX1  (via drill 0.2)
  Top 0.152: INDEX.9 15.25,67.84 14.56,67.15 13.61,67.15 13.48,67.02 13.48,66.35 10.2,63.07 9.09,63.07 v7.8,61.78 | MIDDLE.9 35.25,72.03 36.67,73.46 v36.67,75.8 | RING.9 55.25,65.25 55.65,64.85 57.58,66.78 58.92,66.78 v59.65,67.5
  Route2 0.152: v7.8,61.78 11.26,61.78 16.65,67.17 16.65,74.25 17.38,74.98 v19.33,74.98 25.33,74.98 29.89,79.55 52.05,79.55 v53.2,78.4 50.15,75.35 37.12,75.35 v36.67,75.8 | v56.45,47.65 54.6,45.8 54.6,41.9 57,39.5 58.58,39.5 66.7,47.62 66.7,63.6 62.8,67.5 v59.65,67.5
  Bottom 0.152: THUMB.9 23.75,74.1 22.87,74.98 v19.33,74.98 | LITTLE.9 43.75,72.03 46.67,74.95 46.67,76.16 48.77,78.26 53.05,78.26 v53.2,78.4 | v59.65,67.5 61.25,69.1 61.25,72 54.25,79 37.8,79 36.67,77.87 v36.67,75.8 | IC2.3 56.42,47.67 v56.45,47.65
MUX2  (via drill 0.2)
  Top 0.152: INDEX.10 14.75,68.05 14.16,67.46 13.48,67.46 13.17,67.15 13.17,66.68 11.29,64.8 10.81,64.8 9.58,63.57 8.84,63.57 v7.8,62.53 | MIDDLE.10 34.75,72.24 35.91,73.41 v35.91,75.8 | RING.10 54.75,65.22 55.42,64.55 55.78,64.55 57.35,66.12 59.03,66.12 v59.65,66.74
  Route2 0.152: v7.8,62.53 10.94,62.53 15.89,67.48 15.89,74.25 17.16,75.52 v19.87,75.52 25.43,75.52 29.77,79.85 52.5,79.85 53.73,78.62 v53.73,77.87 50.91,75.05 36.67,75.05 v35.91,75.8 | v56.45,41.3 57.9,39.85 58.5,39.85 66.39,47.74 66.39,63.47 63.13,66.74 v59.65,66.74
  Bottom 0.152: THUMB.10 24.25,74.03 22.98,75.31 20.09,75.31 v19.87,75.52 | LITTLE.10 44.25,72.03 46.97,74.76 46.97,76.03 48.89,77.95 52.89,77.95 52.98,77.87 v53.73,77.87 | v59.65,66.74 61.55,68.65 61.55,72.13 54.38,79.31 37.39,79.31 36.27,78.18 36.27,76.15 v35.91,75.8 | IC2.8 56.42,41.33 v56.45,41.3
MUX3  (via drill 0.2)
  Top 0.152: INDEX.11 14.25,68.26 13.75,67.76 13.36,67.76 12.87,67.27 12.87,66.88 11.61,65.62 10.99,65.62 10.22,64.85 9.8,64.85 9.03,64.07 8.58,64.07 v7.8,63.29 | MIDDLE.11 34.25,72.45 35.16,73.35 v35.16,75.8 | RING.11 54.25,65.29 55.3,64.24 55.9,64.24 57.13,65.47 59.13,65.47 v59.65,65.98
  Route2 0.152: v7.8,63.29 10.63,63.29 15.13,67.79 15.13,74.25 16.94,76.06 v20.41,76.06 25.54,76.06 29.64,80.16 52.62,80.16 54.27,78.51 v54.27,77.33 51.68,74.74 36.22,74.74 v35.16,75.8 | v47.4,41.3 54.4,48.3 56.55,48.3 57.25,47.6 57.25,41.8 57.95,41.1 59.32,41.1 66.09,47.87 66.09,63.35 63.45,65.98 v59.65,65.98
  Bottom 0.152: THUMB.11 24.75,73.96 23.1,75.61 20.86,75.61 v20.41,76.06 | LITTLE.11 44.75,72.03 47.28,74.56 47.28,75.91 49.02,77.65 52.77,77.65 53.08,77.33 v54.27,77.33 | v59.65,65.98 61.86,68.19 61.86,72.25 54.5,79.61 36.98,79.61 35.16,77.78 v35.16,75.8 | IC2.13 47.38,41.33 v47.4,41.3
MUX4  (via drill 0.2)
  Top 0.152: v7.8,64.05 8.32,64.57 8.61,64.57 9.13,65.09 9.54,65.09 10.06,65.61 10.48,65.61 10.99,66.12 11.29,66.12 13.75,68.59 INDEX.12 | MIDDLE.12 33.75,72.65 34.4,73.3 v34.4,75.8 | RING.12 53.75,65.36 55.17,63.94 56.03,63.94 56.9,64.81 59.24,64.81 v59.65,65.22
  Route2 0.152: v7.8,64.05 10.31,64.05 14.37,68.11 14.37,74.25 16.71,76.59 v20.94,76.59 25.64,76.59 29.51,80.46 52.75,80.46 54.81,78.41 v54.81,76.79 52.45,74.44 35.76,74.44 v34.4,75.8 | v47.7,47.7 48.61,48.61 56.68,48.61 57.55,47.73 57.55,41.93 57.98,41.51 59.29,41.51 65.79,48 65.79,63.22 63.78,65.22 v59.65,65.22
  Bottom 0.152: THUMB.12 25.25,73.89 23.23,75.91 21.62,75.91 v20.94,76.59 | LITTLE.12 45.25,72.03 47.58,74.37 47.58,75.78 49.14,77.34 52.64,77.34 53.19,76.8 v54.8,76.8 v54.81,76.79 | v59.65,65.22 62.16,67.74 62.16,72.38 54.63,79.91 36.57,79.91 34.4,77.74 v34.4,75.8 | IC2.18 47.67,47.67 v47.7,47.7
MUX5  (via drill 0.2)
  Top 0.152: v7.8,64.81 7.94,64.81 8.46,65.33 8.87,65.33 9.39,65.85 9.8,65.85 10.52,66.56 10.86,66.56 13.05,68.75 13.05,69.1 13.25,69.3 INDEX.13 | MIDDLE.13 33.25,72.86 33.64,73.25 v33.64,75.8 | RING.13 53.25,65.43 55.05,63.63 56.16,63.63 56.68,64.16 59.34,64.16 v59.65,64.47
  Route2 0.152: v33.64,75.8 35.31,74.13 53.22,74.13 v55.34,76.26 55.34,78.3 52.88,80.77 29.39,80.77 25.75,77.13 v21.48,77.13 16.49,77.13 13.61,74.25 13.61,68.42 10,64.81 v7.8,64.81 7.27,64.27 7.27,52.88 8.5,51.65 23.8,51.65 26.3,49.15 v26.3,47.7
  Bottom 0.152: THUMB.13 25.75,73.82 23.36,76.22 22.39,76.22 v21.48,77.13 | LITTLE.13 45.75,72.03 47.89,74.17 47.89,75.66 49.27,77.04 52.52,77.04 53.29,76.26 v55.34,76.26 | v59.65,64.47 62.47,67.28 62.47,72.5 54.75,80.22 36.16,80.22 33.64,77.69 v33.64,75.8 | IC3.3 26.27,47.67 v26.3,47.7
MUX6  (via drill 0.2)
  Top 0.152: v7.8,65.57 8.2,65.57 8.71,66.09 9.13,66.09 9.65,66.61 10.06,66.61 12.75,69.3 INDEX.14 | MIDDLE.14 32.75,73.07 32.88,73.2 v32.88,75.8 | RING.14 52.75,65.5 54.92,63.33 56.28,63.33 56.46,63.5 59.45,63.5 v59.65,63.71
  Route2 0.152: v32.88,75.8 34.85,73.83 53.99,73.83 v55.88,75.72 55.88,78.2 53,81.07 29.26,81.07 25.85,77.67 v22.02,77.67 16.27,77.67 12.85,74.25 12.85,68.74 9.69,65.57 v7.8,65.57 6.96,64.73 6.96,52.34 8,51.3 23.72,51.3 25.77,49.25 25.77,47.48 26.3,46.95 v26.3,41.35
  Bottom 0.152: THUMB.14 26.25,73.75 23.48,76.52 23.16,76.52 v22.02,77.67 | LITTLE.14 46.25,72.03 48.19,73.97 48.19,75.53 49.4,76.73 52.39,76.73 53.4,75.72 v55.88,75.72 | v59.65,63.71 62.77,66.83 62.77,72.63 54.88,80.52 35.75,80.52 32.88,77.65 v32.88,75.8 | IC3.8 26.27,41.33 v26.3,41.35
MUX7  (via drill 0.2)
  Top 0.152: v7.8,66.33 8.46,66.33 8.97,66.85 9.39,66.85 10.1,67.56 10.45,67.56 12.05,69.17 12.05,69.51 12.25,69.71 INDEX.15 | MIDDLE.15 32.25,73.07 32.12,73.2 v32.12,75.8 | RING.15 52.25,65.56 54.79,63.02 56.28,63.02 56.46,62.85 59.55,62.85 v59.65,62.95
  Route2 0.152: v32.12,75.8 34.4,73.52 54.76,73.52 v56.42,75.18 56.42,78.09 53.13,81.38 29.13,81.38 25.96,78.2 v22.55,78.2 16.05,78.2 12.09,74.25 12.09,69.05 9.37,66.33 v7.8,66.33 6.66,65.19 6.66,52.21 7.87,50.99 15.05,50.99 18.65,47.4 18.65,43.35 16.65,41.35 v13.5,41.35
  Bottom 0.152: THUMB.15 26.9,71.23 26.9,73.54 23.7,76.74 23.7,77.06 v22.55,78.2 | LITTLE.15 46.75,72.03 48.5,73.78 48.5,75.4 49.52,76.43 52.26,76.43 53.5,75.19 v56.41,75.19 v56.42,75.18 | v59.65,62.95 63.08,66.38 63.08,72.76 55.01,80.83 35.34,80.83 32.12,77.6 v32.12,75.8 | IC3.13 13.52,41.33 v13.5,41.35
MUX8  (via drill 0.2)
  Top 0.152: v7.8,67.09 8.71,67.09 9.23,67.61 9.65,67.61 11.75,69.71 INDEX.16 | MIDDLE.16 31.75,72.86 31.36,73.25 v31.36,75.8 | RING.16 51.75,65.63 54.67,62.72 56.16,62.72 56.68,62.19 v59.65,62.19
  Route2 0.152: v31.36,75.8 33.95,73.22 55.52,73.22 v56.95,74.65 56.95,77.98 53.25,81.68 29.01,81.68 26.06,78.74 v23.09,78.74 15.82,78.74 11.34,74.25 11.34,69.37 9.06,67.09 v7.8,67.09 6.35,65.64 6.35,52.08 7.75,50.69 10.46,50.69 v13.5,47.65
  Bottom 0.152: THUMB.16 27.25,73.62 24,76.87 24,77.83 v23.09,78.74 | LITTLE.16 47.25,72.03 48.8,73.59 48.8,75.28 49.65,76.13 52.14,76.13 53.61,74.65 v56.95,74.65 | v59.65,62.19 63.38,65.92 63.38,72.88 55.13,81.13 34.94,81.13 31.36,77.56 v31.36,75.8 | IC3.18 13.52,47.67 v13.5,47.65
MUX9  (via drill 0.2)
  Top 0.152: v7.8,67.85 8.97,67.85 9.69,68.56 10.03,68.56 11.05,69.58 11.05,69.93 11.25,70.12 INDEX.17 | MIDDLE.17 31.25,72.65 30.6,73.3 v30.6,75.8 | RING.17 51.25,65.7 54.54,62.41 56.03,62.41 56.9,61.54 59.54,61.54 v59.65,61.43
  Route2 0.152: v7.8,67.85 8.74,67.85 10.58,69.68 10.58,74.25 15.6,79.28 v23.63,79.28 26.17,79.28 28.88,81.99 53.38,81.99 57.49,77.88 v57.49,74.11 56.29,72.91 33.49,72.91 v30.6,75.8 | v41.35,47.7 46.95,47.7 48.16,48.91 56.8,48.91 57.86,47.85 57.86,42.28 59.64,42.28 65.45,48.09 65.45,58.95 62.97,61.43 v59.65,61.43
  Bottom 0.152: THUMB.17 27.75,73.55 24.32,76.98 24.32,78.58 v23.63,79.28 | LITTLE.17 47.75,72.03 49.11,73.39 49.11,75.15 49.78,75.82 52.01,75.82 53.72,74.11 v57.49,74.11 | v59.65,61.43 63.69,65.47 63.69,73.01 55.26,81.44 34.53,81.44 30.6,77.51 v30.6,75.8 | IC6.3 39.74,47.7 v41.35,47.7
MUX10  (via drill 0.2)
  Top 0.152: v7.8,68.61 9.23,68.61 10.75,70.12 INDEX.18 | MIDDLE.18 30.75,72.45 29.84,73.35 v29.84,75.8 | RING.18 50.75,65.77 54.41,62.11 55.9,62.11 57.13,60.88 59.44,60.88 v59.65,60.67
  Route2 0.152: v7.8,68.61 8.43,68.61 9.82,70 9.82,74.25 15.38,79.81 v24.16,79.81 26.28,79.81 28.75,82.29 53.51,82.29 58.03,77.77 v58.03,73.57 57.06,72.61 33.04,72.61 v29.84,75.8 | v41.35,41.35 40.55,42.15 40.55,48.15 41.61,49.21 56.93,49.21 58.16,47.98 58.16,42.77 59.69,42.77 65.14,48.22 65.14,58.82 63.3,60.67 v59.65,60.67
  Bottom 0.152: THUMB.18 28.25,73.48 24.63,77.1 24.63,79.35 v24.16,79.81 | LITTLE.18 48.25,72.03 49.41,73.19 49.41,75.03 49.9,75.52 51.88,75.52 53.82,73.58 v58.02,73.58 v58.03,73.57 | v59.65,60.67 63.99,65.01 63.99,73.14 55.39,81.74 34.12,81.74 29.84,77.47 v29.84,75.8 | IC6.8 41.33,41.33 v41.35,41.35
MUX11  (via drill 0.2)
  Top 0.152: v7.8,69.36 9.49,69.36 10.25,70.12 INDEX.19 | MIDDLE.19 30.25,72.24 29.48,73.01 29.48,74.98 29.09,75.37 v29.09,75.8 | RING.19 50.25,65.84 54.29,61.8 55.78,61.8 57.35,60.23 59.34,60.23 v59.65,59.91
  Route2 0.152: v29.09,75.8 32.58,72.3 57.83,72.3 v58.56,73.04 58.56,77.67 53.63,82.6 28.63,82.6 26.38,80.35 v24.7,80.35 15.16,80.35 9.06,74.25 9.06,70.31 8.11,69.36 v7.8,69.36 6.05,67.61 6.05,51.96 7.62,50.39 10.33,50.39 12.97,47.75 12.97,41.13 13.28,40.82 26.52,40.82 27,41.3 v28.4,41.3
  Bottom 0.152: THUMB.19 28.75,73.41 24.93,77.23 24.93,80.12 v24.7,80.35 | LITTLE.19 48.87,71.2 48.87,71.82 49.3,72.25 52.14,72.25 52.93,73.04 v58.56,73.04 | v59.65,59.91 64.3,64.56 64.3,73.26 55.51,82.05 33.71,82.05 29.09,77.42 v29.09,75.8 | IC6.13 28.43,41.33 v28.4,41.3
MUX12  (via drill 0.2)
  Top 0.152: INDEX.20 9.75,70.12 v7.8,70.12 | MIDDLE.20 29.75,72.03 28.98,72.8 28.98,74.77 28.84,74.91 28.33,74.91 v28.33,75.8 | RING.20 49.75,65.91 54.16,61.5 55.65,61.5 57.58,59.57 59.23,59.57 v59.65,59.15
  Route2 0.152: v28.33,75.8 32.13,72 58.6,72 v59.1,72.5 59.1,77.56 53.76,82.9 28.5,82.9 26.49,80.89 v25.24,80.89 14.94,80.89 8.3,74.25 8.3,70.62 v7.8,70.12 5.74,68.07 5.74,51.83 7.5,50.08 10.21,50.08 12.66,47.62 12.66,41 13.15,40.51 28.37,40.51 28.93,41.08 28.93,41.52 28.35,42.1 v28.35,47.65
  Bottom 0.152: THUMB.20 29.25,73.34 25.24,77.35 v25.24,80.89 | LITTLE.20 50.12,71.94 52.27,71.94 52.83,72.5 v59.1,72.5 | v59.65,59.15 64.6,64.11 64.6,73.39 55.64,82.35 33.3,82.35 28.33,77.38 v28.33,75.8 | IC6.18 28.38,47.67 v28.35,47.65
MUX_EN  (via drill 0.2)
  Top 0.152: JP3.47 JP3.48 6.08,15.93 v6.15,16
  Route2 0.152: v32.75,61.85 32.75,61.27 32.69,61.2 32.69,57.04 30.22,54.57 10.22,54.57 v8.6,52.95
  Route15 0.152: v8.6,52.95 7.3,51.65 7.3,17.75 6.15,16.6 v6.15,16
  Bottom 0.152: R3.2 33,63.98 32.97,63.95 32.97,63.4 U2.15 32.73,61.88 v32.75,61.85
N$3
  Top 0.152: R1.1 36.59,51.78 SCLPU.2
N$4
  Top 0.152: R2.1 32.17,51.82 SDAPU.2
N$55
  Top 0.152: JP3.25 JP3.26
N$57
  Top 0.152: JP3.29 JP3.30
N$60
  Top 0.152: JP3.36 JP3.35
N$61
  Top 0.152: JP3.38 JP3.37
N$62
  Top 0.152: JP3.40 JP3.39
N$63
  Top 0.152: JP3.42 JP3.41
N$64
  Top 0.152: JP3.44 JP3.43
N$65
  Top 0.152: JP3.46 JP3.45
N$72
  Top 0.152: JP4.12 JP4.11
N$80
  Top 0.152: JP4.28 JP4.27
N$82
  Top 0.152: JP4.32 JP4.31
N$83
  Top 0.152: JP4.34 JP4.33
N$84
  Top 0.152: JP4.36 JP4.35
N$85
  Top 0.152: JP4.38 JP4.37
N$86
  Top 0.152: JP4.40 JP4.39
N$87
  Top 0.152: JP4.42 JP4.41
N$88
  Top 0.152: JP4.44 JP4.43
N$89
  Top 0.152: JP4.46 JP4.45
N$90
  Top 0.152: JP4.48 JP4.47
PREMUX1  (via drill 0.2)
  Route2 0.152: v56.5,50.25 55.53,51.22 55.53,52.22 54.7,53.05 49.92,53.05 39.68,63.3 35.21,63.3 32.99,61.08 v32.99,54.69
  Bottom 0.152: IC2.1 56.47,50.22 v56.5,50.25 | U2.9 33.38,55.07 v32.99,54.69 32.79,54.49 30.94,54.49 R5.1
PREMUX2  (via drill 0.2)
  Route2 0.152: v55,52 54.25,52.75 49.79,52.75 39.55,62.99 35.34,62.99 34.42,62.08 34.42,55.49 33.83,54.89 v33.83,54.69
  Route15 0.152: v56.5,38.8 55,40.3 v55,52
  Bottom 0.152: U2.8 33.83,55.64 v33.83,54.69 33.75,54.69 33.21,54.16 32.11,54.16 R7.1 | IC2.10 56.48,38.78 v56.5,38.8
PREMUX3  (via drill 0.2)
  Route2 0.152: v53.8,52 50.11,52 39.43,62.69 35.47,62.69 34.79,62.02 34.79,54.76 v34.67,54.64
  Route15 0.152: v43.6,38.75 53.8,48.95 v53.8,52
  Bottom 0.152: IC2.11 43.63,38.78 v43.6,38.75 | U2.7 v34.67,54.64 34.56,54.52 34.56,54.47 34.24,54.16 33.65,54.16 33.34,53.85 33.3,53.85 R8.1
PREMUX4  (via drill 0.2)
  Route2 0.152: v43.5,50.2 43.5,51.92 45.86,54.27 45.86,55.83 39.3,62.38 35.59,62.38 35.28,62.07 35.28,61.63 35.48,61.44 v35.48,54.49
  Bottom 0.152: U2.6 35.48,55.69 v35.48,54.49 35.44,54.49 R9.1 | IC2.20 43.52,50.22 v43.5,50.2
PREMUX5  (via drill 0.2)
  Route2 0.152: v36.27,54.49 36.27,54.09 36.09,53.91 30.06,53.91 v26.35,50.2
  Bottom 0.152: U2.5 35.98,54.79 v36.27,54.49 36,54.22 R10.1 | IC3.1 26.34,50.22 v26.35,50.2
PREMUX6  (via drill 0.2)
  Route2 0.152: v26.3,39.15 27.36,40.21 28.49,40.21 29.24,40.95 29.24,47.52 26.88,49.87 26.88,50.3 30.18,53.6 36.44,53.6 37.08,54.24 v37.08,54.54
  Bottom 0.152: U2.4 36.62,54.99 v37.08,54.54 36.87,54.34 37.5,53.71 R11.1 | IC3.10 25.94,38.78 v26.3,39.15
PREMUX7  (via drill 0.2)
  Route2 0.152: v13.4,38.25 26.15,38.25 27.81,39.9 28.62,39.9 29.54,40.83 29.54,47.64 27.19,50 27.19,50.17 30.31,53.3 36.79,53.3 37.88,54.39 v37.88,54.54
  Bottom 0.152: U2.3 37.27,55.14 v37.88,54.54 37.88,54.17 38.5,53.55 R12.1 | IC3.11 13.93,38.78 v13.4,38.25
PREMUX8  (via drill 0.2)
  Route2 0.152: v10.92,48.62 12.36,47.18 12.36,38.54 13.18,37.72 26.05,37.72 27.93,39.6 28.74,39.6 29.85,40.7 29.85,47.77 27.81,49.81 27.81,50.36 30.44,52.99 37.13,52.99 38.66,54.52 v38.66,54.54
  Bottom 0.152: U2.2 37.92,55.27 v38.66,54.54 39.04,54.15 39.39,54.15 40,53.55 R13.1 | IC3.20 12.52,50.22 v10.92,48.62
PREMUX9  (via drill 0.2)
  Route2 0.152: v41.35,50.2 45.55,54.4 45.55,55.7 39.85,61.4 v38.54,61.4
  Bottom 0.152: R14.1 38.62,64.95 37.92,64.25 U2.23 37.92,62.15 38.54,61.54 v38.54,61.4 | IC6.1 41.34,50.22 v41.35,50.2
PREMUX10  (via drill 0.2)
  Route2 0.152: v41.25,38.8 41.25,40.7 40.24,41.7 40.24,49.95 44.31,54.01 44.31,56.51 40,60.82 38.37,60.82 37.52,61.67 v37.52,61.74
  Bottom 0.152: R15.1 37.27,64.67 U2.22 37.27,61.98 v37.52,61.74 | IC6.10 41.23,38.78 v41.25,38.8
PREMUX11  (via drill 0.2)
  Route2 0.152: v32.35,38.5 34.35,38.5 39.94,44.09 39.94,50.07 44.01,54.14 44.01,56.38 39.87,60.51 37.89,60.51 36.79,61.62 36.79,61.63 v36.58,61.84
  Bottom 0.152: R16.1 36.62,64.38 U2.21 36.62,61.88 v36.58,61.84 | v32.35,38.5 32.06,38.78 IC6.11
PREMUX12  (via drill 0.2)
  Route2 0.152: v28.6,50.2 39.64,50.2 43.7,54.26 43.7,56.26 39.75,60.21 37.46,60.21 v35.82,61.85 v35.81,61.85
  Bottom 0.152: R17.1 34.85,64.95 35.98,63.83 U2.20 35.98,62.15 35.81,61.99 v35.81,61.85 | IC6.20 28.62,50.22 v28.6,50.2
PWM1
  Top 0.152: JP3.16 JP3.15 44.47,9.47 38.44,9.47 37,8.03 J2.9
PWM2
  Top 0.152: JP3.18 JP3.17 42.34,9.88 38.18,9.88 36,7.7 J2.8
PWM3
  Top 0.152: JP3.20 JP3.19 40.21,10.29 37.59,10.29 35,7.7 J2.7
PWM4
  Top 0.152: JP3.22 JP3.21 38.02,11.72 34,7.7 J2.6
PWM5
  Top 0.152: JP3.24 JP3.23 33,8.16 J2.5
PWM6
  Top 0.152: JP3.28 JP3.27 31.48,8.22 32,7.7 J2.4
PWM7
  Top 0.152: JP3.32 JP3.31 27.51,11.72 31,8.23 J2.3
PWM8
  Top 0.152: JP3.34 JP3.33 25.89,9.69 29.12,9.69 30,8.8 J2.2
RESET  (via drill 0.2)
  Top 0.152: R6.2 37.65,37.65 v37.7,37.6 | v36.8,45.95 36.77,45.98 U1.3
  Route2 0.152: v37.7,37.6 37.1,37.01 32.38,37.01 31.34,38.04 31.34,39.39 36.8,44.85 v36.8,45.95
RING_C1  (via drill 0.2)
  Top 0.152: IC4.12 17.86,58.42 v19.13,57.15 | v59.83,69.4 59.03,70.2 59,70.2 58.75,70.45 RING.2
  Route15 0.152: v19.13,57.15 21.59,54.69 29.45,54.69 34.85,49.29 40.64,49.29 40.88,49.06 41.82,49.06 42.05,49.29 42.8,49.29 43.03,49.06 43.97,49.06 44.64,49.73 44.64,50.23 58.11,63.7 58.11,67.68 v59.83,69.4
RING_C2  (via drill 0.2)
  Top 0.152: IC4.14 v20.41,57.15 | RING.4 57.75,69.96 v58.31,69.4
  Route15 0.152: v20.41,57.15 22.56,54.99 29.58,54.99 34.98,49.59 40.77,49.59 41,49.36 41.7,49.36 41.93,49.59 42.92,49.59 43.15,49.36 43.85,49.36 44.34,49.85 44.34,50.36 57.8,63.82 57.8,68.89 v58.31,69.4
RING_C3  (via drill 0.2)
  Top 0.152: IC4.15 v21.68,57.15 | RING.3 58.25,70.22 v59.07,69.4
  Route15 0.152: v21.68,57.15 23.52,55.3 29.7,55.3 35.1,49.9 40.9,49.9 41.13,49.67 41.57,49.67 41.8,49.9 43.05,49.9 43.28,49.67 43.72,49.67 44.03,49.98 44.03,50.48 57.5,63.95 57.5,69.34 58.09,69.93 58.54,69.93 v59.07,69.4
RING_C4  (via drill 0.2)
  Top 0.152: IC4.11 16.59,57.77 17.21,57.15 v17.86,57.15 | RING.1 59.25,70.74 v60.59,69.4
  Route15 0.152: v17.86,57.15 20.63,54.39 29.32,54.39 34.73,48.99 40.52,48.99 40.75,48.75 41.95,48.75 42.18,48.99 42.67,48.99 42.9,48.75 44.1,48.75 44.95,49.6 44.95,50.1 58.41,63.57 58.41,67.23 v60.59,69.4
RING_SCL  (via drill 0.2)
  Top 0.152: U1.11 31.57,46.33 31.59,46.32 v31.59,45.77 | RING.8 55.72,71.05 55.72,69.08 v55.78,69.01
  Route2 0.152: v55.78,69.01 56.34,68.45 62.28,68.45 67,63.73 67,47.49 66.1,46.59 66.1,46.25 56.55,36.7 32.25,36.7 30.47,38.48 30.47,38.98 34.63,43.15 34.63,44.42 33.28,45.77 v31.59,45.77
RING_SDA  (via drill 0.2)
  Top 0.152: U1.10 32.23,45.52 v32.55,45.2 | RING.7 56.35,70.98 v56.35,69.6
  Route2 0.152: v56.35,69.6 57.2,68.75 62.41,68.75 67.31,63.85 67.31,47.37 66.41,46.46 66.41,46.12 56.68,36.39 32.12,36.39 30.16,38.36 30.16,39.46 34.15,43.45 34.15,44.3 33.25,45.2 v32.55,45.2
SP4T_A0  (via drill 0.2)
  Top 0.152: JP3.11 JP3.12 51.8,14.91 48.25,18.46 48.25,33.59 46.95,34.89 44.1,34.89 42.89,36.11 31.75,36.11 28.25,39.6 28.25,40.15 26.22,42.19 IC5.10 21.07,42.19 20.05,43.2 20.05,52.09 15.32,56.83 IC4.10 15.15,59.14 v15.15,60.95 | IC1.10 31.32,60.12 v30.86,60.59
  Bottom 0.152: v30.86,60.59 30.34,60.59 30.27,60.52 26.35,60.52 24.68,62.18 15.78,62.18 15.15,61.55 v15.15,60.95
SP4T_A1  (via drill 0.2)
  Top 0.152: JP3.13 JP3.14 47.86,15.66 47.86,33.44 46.71,34.59 43.98,34.59 42.76,35.8 31.62,35.8 28.03,39.38 27.17,39.38 25.63,40.91 IC5.9 21.91,40.91 19.75,43.07 19.75,51.97 14.05,57.66 IC4.9 14.05,60.61 v14.39,60.95 | IC1.9 v30.05,61.05
  Bottom 0.152: v30.05,61.05 26.25,61.05 24.81,62.49 15.66,62.49 14.39,61.22 v14.39,60.95
SP16T_A0  (via drill 0.2)
  Top 0.152: JP3.3 JP3.4
  Route2 0.152: v29.7,56.2 28.09,57.81 28.09,65.29 29.11,66.31 51.24,66.31 63.16,54.39 v63.16,48.85
  Bottom 0.152: U2.10 32.48,55.6 32.48,55.05 32.22,54.8 31.11,54.8 v29.7,56.2 | v63.16,48.85 63.16,35.13 60.8,32.77 60.8,26.94 58.86,25 58.86,24.05 58.87,24.04 58.87,16.35 60.96,14.26 JP3.4
SP16T_A1  (via drill 0.2)
  Top 0.152: JP3.5 JP3.6
  Route2 0.152: v32.05,57.35 28.44,60.96 28.44,65.14 29.26,65.96 51.09,65.96 62.06,54.99 v62.06,48.85
  Bottom 0.152: U2.11 32.08,57.33 v32.05,57.35 | v62.06,48.85 62.06,34.46 60.5,32.89 60.5,27.14 58.56,25.21 58.56,23.92 58.56,15.12 JP3.6
SP16T_A2  (via drill 0.2)
  Top 0.152: JP3.7 JP3.8
  Route2 0.152: v32.1,61.45 31.92,61.27 31.18,61.27 28.8,63.65 28.8,65 29.4,65.61 50.95,65.61 60.95,55.6 v60.95,48.85
  Bottom 0.152: U2.14 32.08,61.48 v32.1,61.45 | v60.95,48.85 60.95,36.01 58.25,33.3 58.25,23.87 58.25,16.23 56.88,14.86 JP3.8
SP16T_A3  (via drill 0.2)
  Top 0.152: JP3.9 JP3.10
  Route2 0.152: v31.4,61.8 29.15,64.05 29.15,64.85 29.55,65.25 50.8,65.25 59.85,56.2 v59.85,48.85
  Bottom 0.152: U2.13 31.43,61.83 v31.4,61.8 | v59.85,48.85 59.85,35.9 57.95,34 57.95,24 57.94,23.99 57.94,16.35 57.39,15.8 55.5,15.8 54.34,14.64 JP3.10
THUMB_C1  (via drill 0.2)
  Top 0.152: IC5.12 22.07,44.73 v22.05,44.7
  Route15 0.152: v22.05,44.7 22.63,45.28 22.63,48.67 22.27,49.03 17.76,49.03 13.33,44.59 11.42,44.59 9.09,46.93 9.09,48.48 10.61,50 10.61,53.36 6.09,57.87 6.09,69.88 8.82,72.61 19.6,72.61 20.98,71.23 20.98,69.61 21.02,69.56 v21.02,69.24
  Bottom 0.152: THUMB.2 20.37,70.96 20.37,70.33 21.02,69.68 v21.02,69.24
THUMB_C2  (via drill 0.2)
  Top 0.152: IC5.14 22.16,47.27 v22.1,47.2
  Route15 0.152: v22.54,69.24 22.04,69.74 22.04,71.69 20.51,73.21 8.57,73.21 5.49,70.13 5.49,57.62 10,53.1 10,50.25 8.48,48.73 8.48,46.67 11.17,43.99 13.58,43.99 16.79,47.2 v22.1,47.2
  Bottom 0.152: THUMB.4 21.37,70.96 21.37,70.33 21.51,70.2 21.57,70.2 v22.54,69.24
THUMB_C3  (via drill 0.2)
  Top 0.152: IC5.15 22.09,48.53 v22.05,48.5
  Route15 0.152: v22.05,48.5 17.66,48.5 13.45,44.29 11.3,44.29 8.79,46.8 8.79,48.61 10.31,50.13 10.31,53.23 5.79,57.75 5.79,70 8.7,72.91 20.06,72.91 21.28,71.69 21.28,69.74 v21.78,69.24
  Bottom 0.152: THUMB.3 20.87,70.96 20.87,70.33 21.78,69.42 v21.78,69.24
THUMB_C4  (via drill 0.2)
  Top 0.152: IC5.11 22.05,43.45 v22,43.4
  Route15 0.152: v20.26,69.24 19.76,69.74 19.76,71 19.76,71.69 19.15,72.3 8.95,72.3 6.4,69.75 6.4,58 10.92,53.48 10.92,49.88 9.4,48.35 9.4,47.05 11.55,44.9 13.2,44.9 17.64,49.34 22.4,49.34 22.94,48.8 22.94,44.34 v22,43.4
  Bottom 0.152: v20.26,69.24 19.75,69.75 THUMB.1
THUMB_SCL  (via drill 0.2)
  Top 0.127: 34.25,44.7 34.23,44.68 28.62,44.68 27.2,46.1
  Top 0.152: U1.5 35.48,45.92 34.25,44.7 | v25.6,64.85 25.6,53.58 27.2,51.98 27.2,46.1
  Bottom 0.152: v25.6,64.85 25.6,68.73 24.13,70.2 23.51,70.2 23.37,70.33 23.37,70.96 THUMB.8
THUMB_SDA  (via drill 0.2)
  Top 0.152: U1.4 36.12,46.11 34.36,44.34 28.47,44.34 26.89,45.92 26.89,51.86 24.84,53.91 v24.84,64.85
  Bottom 0.152: v24.84,64.85 24.84,68.99 23.93,69.89 23.31,69.89 22.87,70.33 22.87,70.96 THUMB.7

### Text on the board
bPlace: 5SCL | 6SCL | 7SCL | 5SDA | 6SDA | 7SDA | 5V | Teensy 4.1 Plug-In | GND | CTX | CRX